# EAGLE design femto-beacon-esp32 (EAGLE 9.3.0)

## Sheet 1 of 7
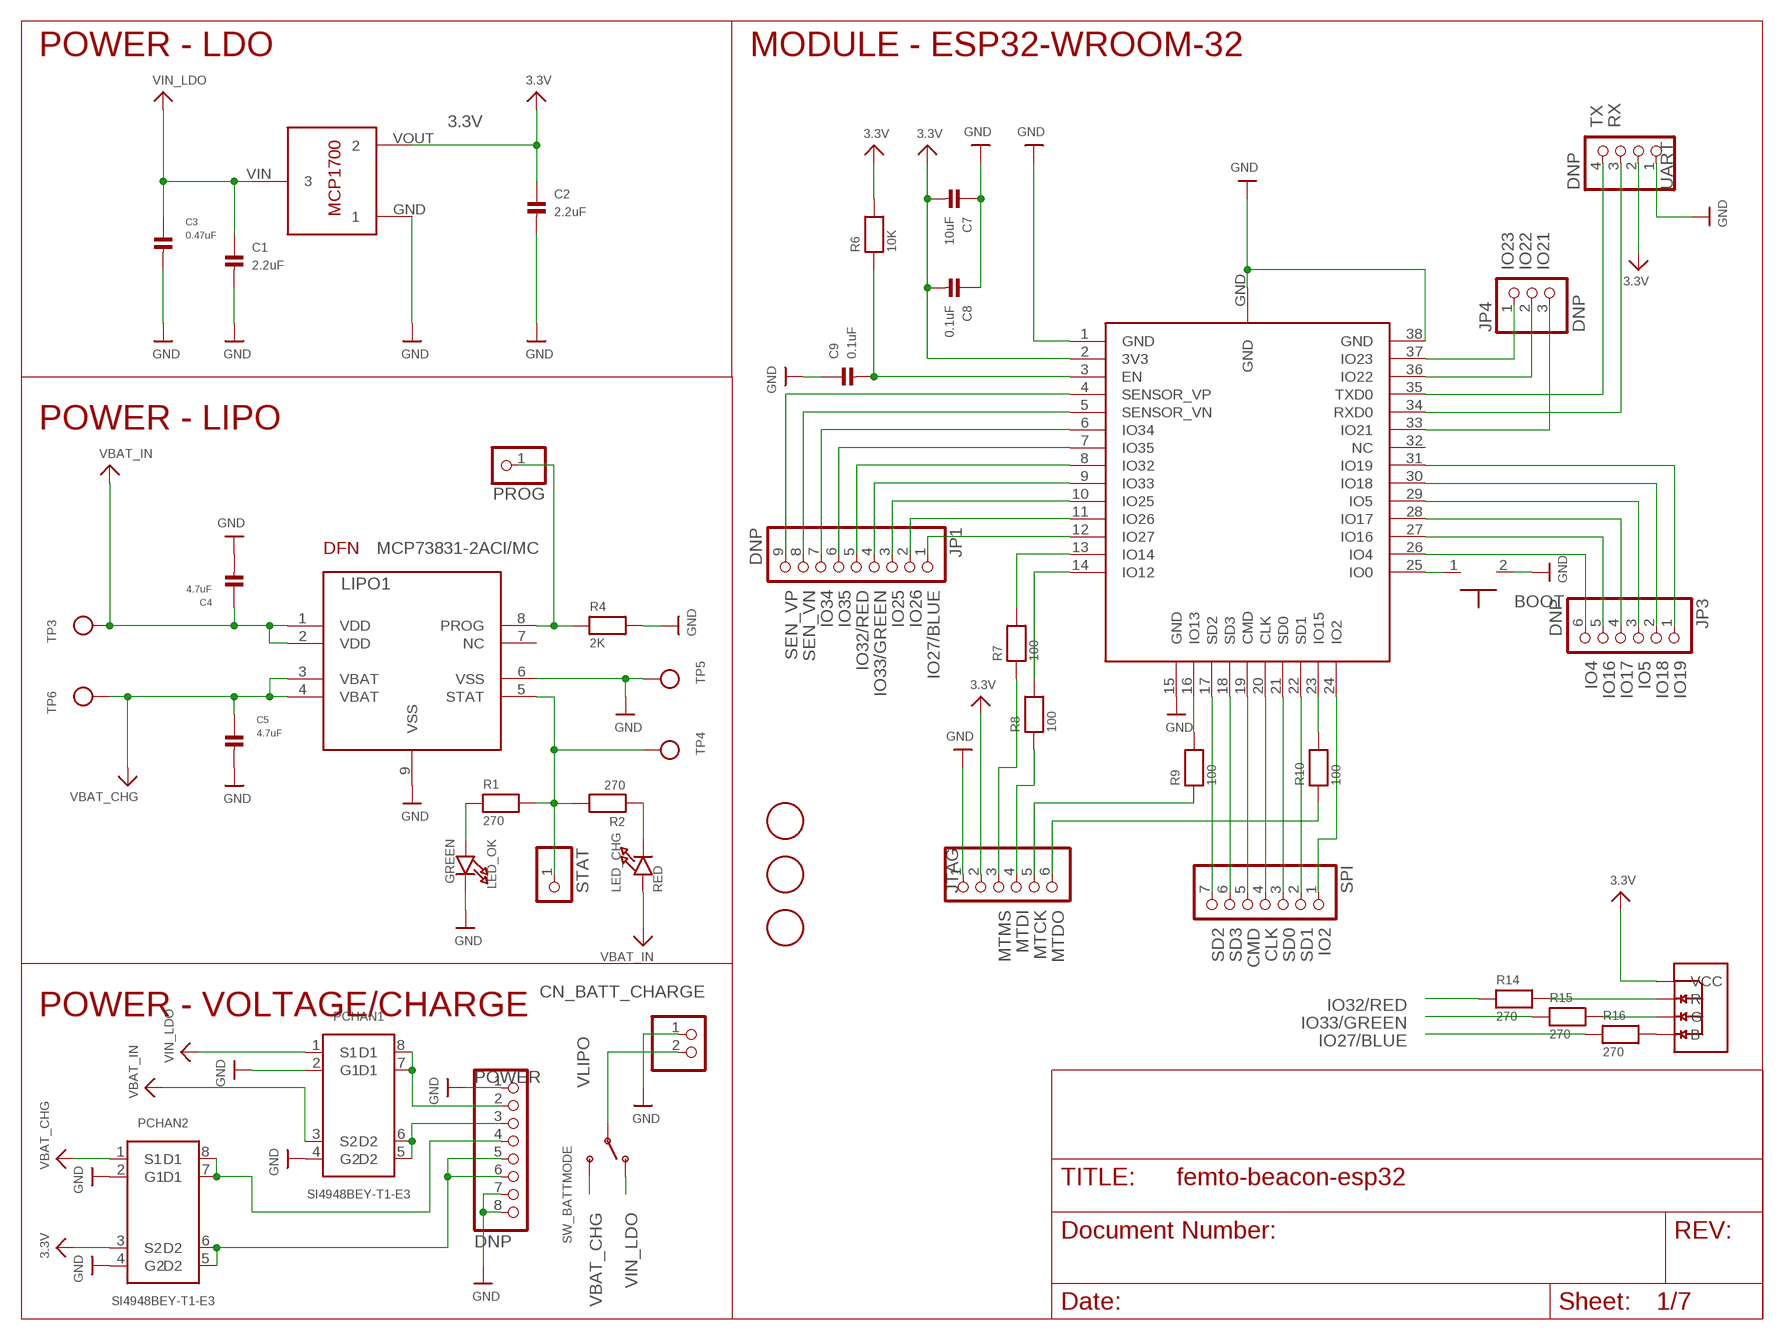
[diagram p0: schematic, sheet 1]

### Parts
BOOT  TACTILE_SWITCH_NO_GND_NO_BOSS  [SIDE_ACT_NO_GND_NO_BOSS]
C1  2.2uF  CAP_CERAMIC_0402MP  [_0402MP]
C2  2.2uF  CAP_CERAMIC_0402MP  [_0402MP]
C3  0.47uF  CAP_CERAMIC_0402MP  [_0402MP]
C4  4.7uF  CAP_CERAMIC_0402MP  [_0402MP]
C5  4.7uF  CAP_CERAMIC_0402MP  [_0402MP]
C7  10uF  CAP_CERAMIC_0603MP  [_0603MP]
C8  0.1uF  CAP_CERAMIC_0402MP  [_0402MP]
C9  0.1uF  CAP_CERAMIC_0402MP  [_0402MP]
CN_BATT_CHARGE  JST_2PIN  [JSTPH2]
FID1  FIDUCIAL  [FIDUCIAL_1MM]
FID2  FIDUCIAL  [FIDUCIAL_1MM]
FID3  FIDUCIAL  [FIDUCIAL_1MM]
JP1  DNP  PINHD-1X9  [1X09]
JP3  DNP  PINHD-1X6  [1X06]
JP4  DNP  PINHD-1X3  [1X03]
JTAG  HEADER-1X6ROUND  [1X06_ROUND]
LDO1  3.3V  MCP1700T-3302E/TT  [MCP1700T-3302E/TT]
LED_CHG  RED  LED0603_NOOUTLINE  [CHIPLED_0603_NOOUTLINE]
LED_OK  GREEN  LED0603_NOOUTLINE  [CHIPLED_0603_NOOUTLINE]
LIPO1  MCP73831-2ACI/MC  [2X3_DFN]
MOD1  ESP32-WROOM-32  [ESP32-WROOM-32-MODULE]
PCHAN1  SI4948BEY-T1-E3  [SO-8]
PCHAN2  SI4948BEY-T1-E3  [SO-8]
POWER  DNP  HEADER-1X8  [1X08_OVAL]
PROG  HEADER-1X1ROUND  [1X01_ROUND]
R1  270  RESISTOR_0402MP  [_0402MP]
R2  270  RESISTOR_0402MP  [_0402MP]
R4  2K  RESISTOR_0402MP  [_0402MP]
R6  10K  RESISTOR_0402MP  [_0402MP]
R7  100  RESISTOR_0402MP  [_0402MP]
R8  100  RESISTOR_0402MP  [_0402MP]
R9  100  RESISTOR_0402MP  [_0402MP]
R10  100  RESISTOR_0402MP  [_0402MP]
R14  270  RESISTOR_0402MP  [_0402MP]
R15  270  RESISTOR_0402MP  [_0402MP]
R16  270  RESISTOR_0402MP  [_0402MP]
RGB1  LRTB_R48G  [LRTB_R48G]
SPI  HEADER-1X7ROUND  [1X07_ROUND]
STAT  HEADER-1X1ROUND  [1X01_ROUND]
SW_BATTMODE  SWITCH_SPDT  [SPDT_SMT_SSSS811101]
TP3  TESTPOINTROUND0.5MM  [TESTPOINT_ROUND_0.5MM]
TP4  TESTPOINTROUND0.5MM  [TESTPOINT_ROUND_0.5MM]
TP5  TESTPOINTROUND0.5MM  [TESTPOINT_ROUND_0.5MM]
TP6  TESTPOINTROUND0.5MM  [TESTPOINT_ROUND_0.5MM]
UART  DNP  HEADER-1X4ROUND  [1X04_ROUND]

### Nets
BOOT: BOOT.1 MOD1.25(IO0)
CLK: MOD1.20(CLK) SPI.4
CMD: MOD1.19(CMD) SPI.5
EN: C9.2 MOD1.3(EN) R6.1
GND: BOOT.2 C1.2 C2.2 C3.2 C4.2 C5.2 C7.1 C8.1 C9.1 CN_BATT_CHARGE.1 JTAG.1 LDO1.GND LED_OK.C LIPO1.6(VSS) LIPO1.9(VSS) MOD1.1(GND) MOD1.15(GND) MOD1.38(GND) MOD1.GND PCHAN1.2(G1) PCHAN1.4(G2) PCHAN2.2(G1) PCHAN2.4(G2) POWER.1 POWER.7 POWER.8 R4.2 TP5.P$1 UART.1 ; also sheet 2
IO2: MOD1.24(IO2) SPI.1
IO4: JP3.6 MOD1.26(IO4)
IO5: JP3.3 MOD1.29(IO5)
IO16: JP3.5 MOD1.27(IO16)
IO17: JP3.4 MOD1.28(IO17)
IO18: JP3.2 MOD1.30(IO18)
IO19: JP3.1 MOD1.31(IO19)
IO21: JP4.3 MOD1.33(IO21)
IO22: JP4.2 MOD1.36(IO22)
IO23: JP4.1 MOD1.37(IO23)
IO25: JP1.3 MOD1.10(IO25)
IO26: JP1.2 MOD1.11(IO26)
IO27/BLUE: JP1.1 MOD1.12(IO27) R16.1
IO32/RED: JP1.5 MOD1.8(IO32) R14.1
IO33/GREEN: JP1.4 MOD1.9(IO33) R15.1
IO34: JP1.7 MOD1.6(IO34)
IO35: JP1.6 MOD1.7(IO35)
MTCK: JTAG.5 R9.1
MTDI: JTAG.4 R8.1
MTDI_: MOD1.14(IO12) R8.2
MTDO: JTAG.6 R10.1
MTMS: JTAG.3 R7.1
N$1: PCHAN1.7(D1) PCHAN1.8(D1) POWER.2
N$6: R16.2 RGB1.4(B)
N$7: MOD1.13(IO14) R7.2
N$8: R15.2 RGB1.3(G)
N$9: LED_OK.A R1.1
N$10: LED_CHG.C R2.1
N$11: R14.2 RGB1.2(R)
N$14: PCHAN1.5(D2) PCHAN1.6(D2) POWER.3
N$15: PCHAN2.7(D1) PCHAN2.8(D1) POWER.4
N$16: PCHAN2.5(D2) PCHAN2.6(D2) POWER.5 POWER.6
N$18: MOD1.16(IO13) R9.2
N$19: MOD1.23(IO15) R10.2
PROG: LIPO1.8(PROG) PROG.1 R4.1
RX: MOD1.34(RXD0) UART.3 ; also sheet 2
SD0: MOD1.21(SD0) SPI.3
SD1: MOD1.22(SD1) SPI.2
SD2: MOD1.17(SD2) SPI.7
SD3: MOD1.18(SD3) SPI.6
SEN_VN: JP1.8 MOD1.5(SENSOR_VN)
SEN_VP: JP1.9 MOD1.4(SENSOR_VP)
STAT: LIPO1.5(STAT) R1.2 R2.2 STAT.1 TP4.P$1
TX: MOD1.35(TXD0) UART.4 ; also sheet 2
VBAT_CHG: C5.1 LIPO1.3(VBAT) LIPO1.4(VBAT) PCHAN2.1(S1) SW_BATTMODE.C(S) TP6.P$1
VBAT_IN: C4.1 LED_CHG.A LIPO1.1(VDD) LIPO1.2(VDD) PCHAN1.3(S2) TP3.P$1 ; also sheet 2
VCC: C2.1 C7.2 C8.2 JTAG.2 LDO1.VOUT MOD1.2(3V3) PCHAN2.3(S2) R6.2 RGB1.1(VCC) UART.2 ; supply symbol labelled 3.3V
VIN_LDO: C1.1 C3.1 LDO1.VIN PCHAN1.1(S1) SW_BATTMODE.A(O) ; also sheet 2
VLIPO: CN_BATT_CHARGE.2 SW_BATTMODE.B(P)
Unconnected: LIPO1.7(NC) MOD1.32(NC)

### Notes on the sheet
- POWER - LDO | MODULE - ESP32-WROOM-32
- POWER - LIPO
- POWER - VOLTAGE/CHARGE

## Sheet 2 of 7
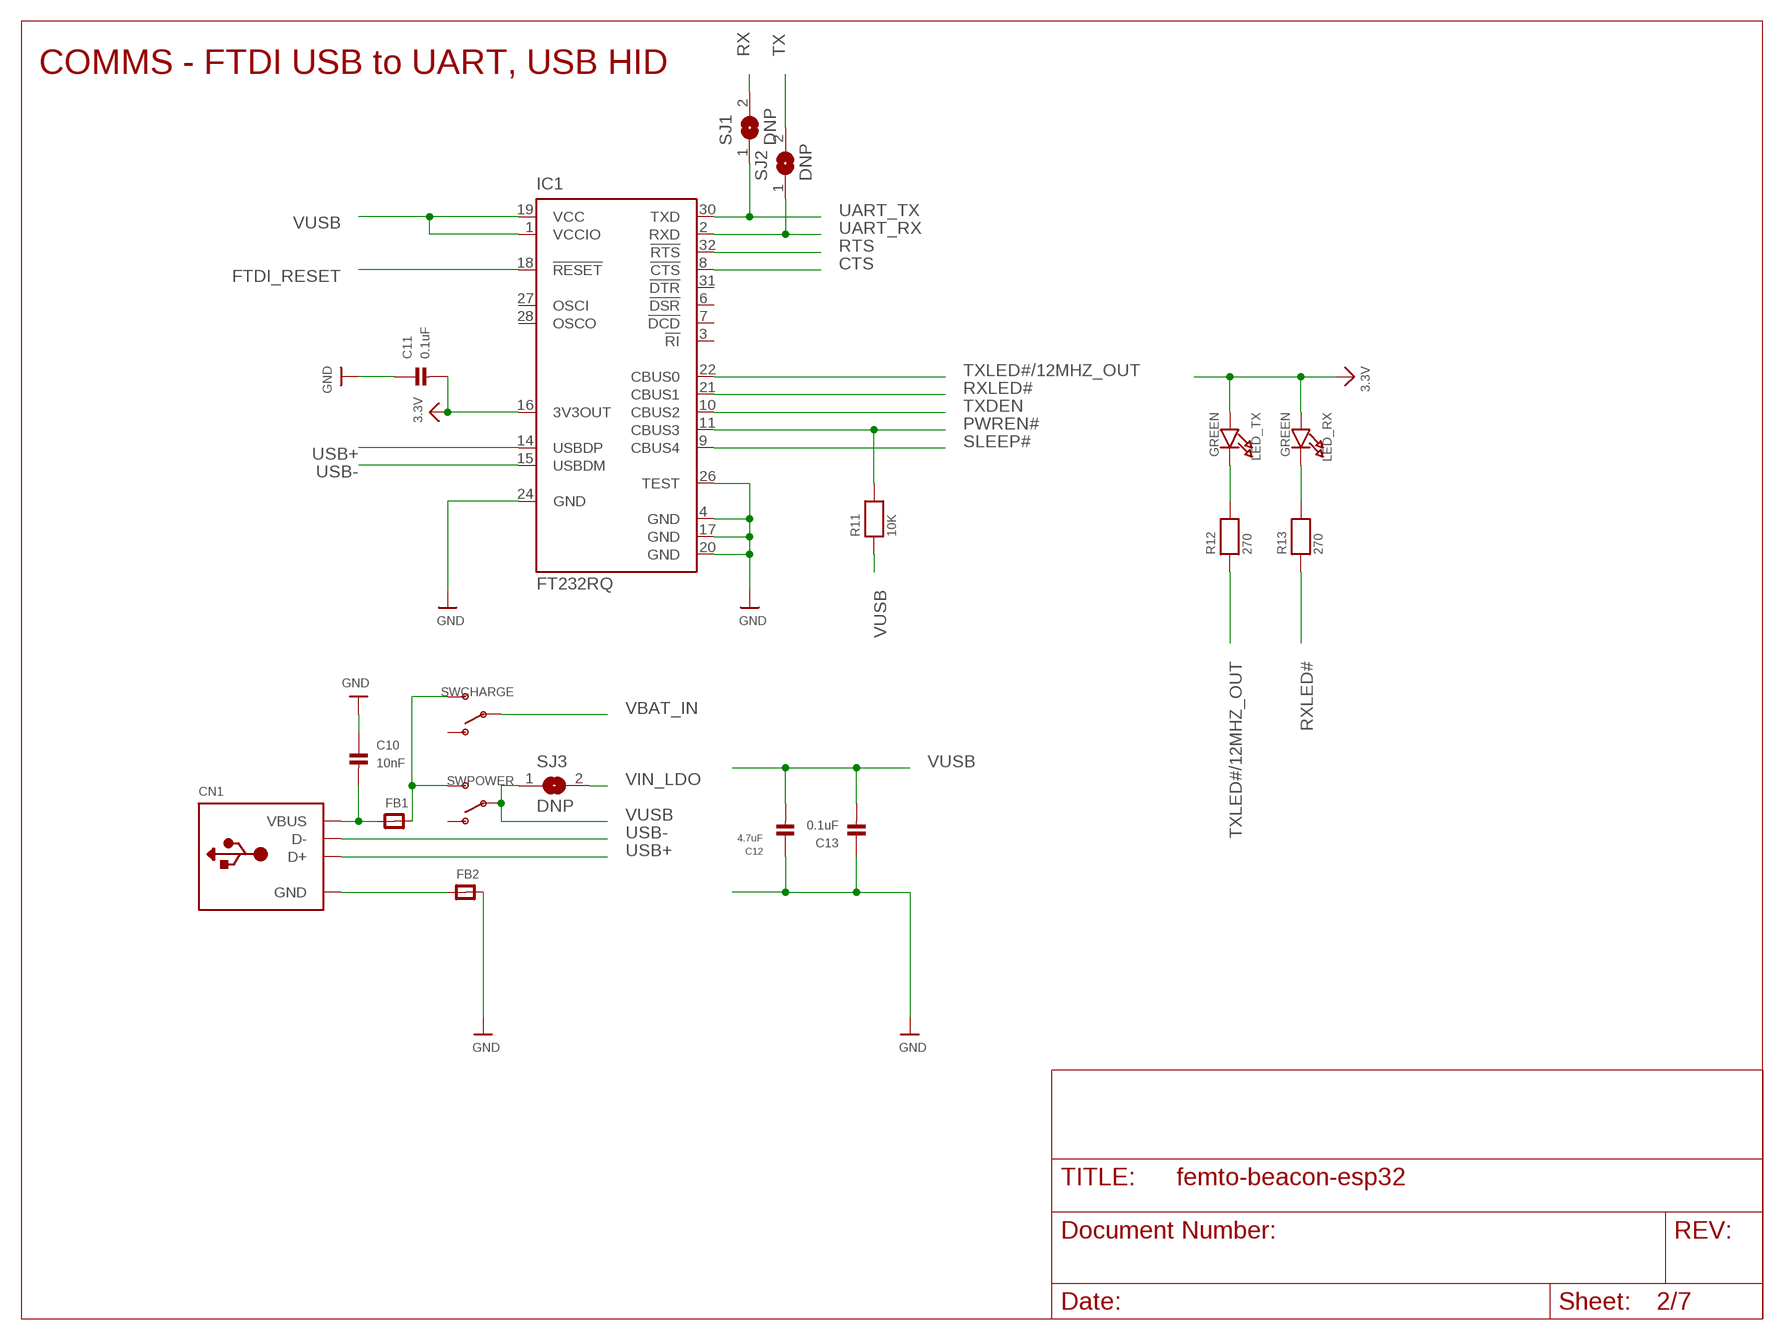
[diagram p1: schematic, sheet 2]

### Parts
C10  10nF  CAP_CERAMIC_0402MP  [_0402MP]
C11  0.1uF  CAP_CERAMIC_0402MP  [_0402MP]
C12  4.7uF  CAP_CERAMIC_0402MP  [_0402MP]
C13  0.1uF  CAP_CERAMIC_0402MP  [_0402MP]
CN1  USB_TYPEA  [USB_A-SMT]
FB1  FERRITE_0603MP  [_0603MP]
FB2  FERRITE_0603MP  [_0603MP]
IC1  FT232RQ  [QFN32]
LED_RX  GREEN  LED0603_NOOUTLINE  [CHIPLED_0603_NOOUTLINE]
LED_TX  GREEN  LED0603_NOOUTLINE  [CHIPLED_0603_NOOUTLINE]
R11  10K  RESISTOR_0402MP  [_0402MP]
R12  270  RESISTOR_0402MP  [_0402MP]
R13  270  RESISTOR_0402MP  [_0402MP]
SJ1  DNP  SOLDERJUMPERCLOSED  [SOLDERJUMPER_CLOSEDWIRE]
SJ2  DNP  SOLDERJUMPERCLOSED  [SOLDERJUMPER_CLOSEDWIRE]
SJ3  DNP  SOLDERJUMPERCLOSED  [SOLDERJUMPER_CLOSEDWIRE]
SWCHARGE  SWITCH_SPDT  [SPDT_SMT_SSSS811101]
SWPOWER  SWITCH_SPDT  [SPDT_SMT_SSSS811101]

### Nets
3.3V: C11.2 IC1.16(3V3OUT) LED_RX.A LED_TX.A
CTS: IC1.8(!CTS)
FTDI_RESET: IC1.18(!RESET)
GND: C10.1 C11.1 C12.1 C13.1 FB2.2 IC1.4(GND) IC1.17(GND) IC1.20(GND) IC1.24(GND) IC1.26(TEST) ; also sheet 1
GND_: CN1.GND FB2.1
N$4: LED_TX.C R12.2
N$5: LED_RX.C R13.2
PWREN#: IC1.11(CBUS3) R11.2
RTS: IC1.32(!RTS)
RX: SJ1.2 ; also sheet 1
RXLED#: IC1.21(CBUS1) R13.1
SLEEP#: IC1.9(CBUS4)
TX: SJ2.2 ; also sheet 1
TXDEN: IC1.10(CBUS2)
TXLED#/12MHZ_OUT: IC1.22(CBUS0) R12.1
UART_RX: IC1.2(RXD) SJ2.1
UART_TX: IC1.30(TXD) SJ1.1
USB+: CN1.D+ IC1.14(USBDP)
USB-: CN1.D- IC1.15(USBDM)
VBAT_IN: SWCHARGE.B(P) ; also sheet 1
VIN_LDO: SJ3.2 ; also sheet 1
VUSB: C12.2 C13.2 IC1.1(VCCIO) IC1.19(VCC) R11.1 SJ3.1 SWPOWER.B(P)
VUSB_: C10.2 CN1.VBUS FB1.1
VUSB_FILTERED: FB1.2 SWCHARGE.C(S) SWPOWER.C(S)
Unconnected: IC1.3(!RI) IC1.6(!DSR) IC1.7(!DCD) IC1.27(OSCI) IC1.28(OSCO) IC1.31(!DTR) SWCHARGE.A(O) SWPOWER.A(O)

### Notes on the sheet
- COMMS - FTDI USB to UART, USB HID

## Sheet 3 of 7
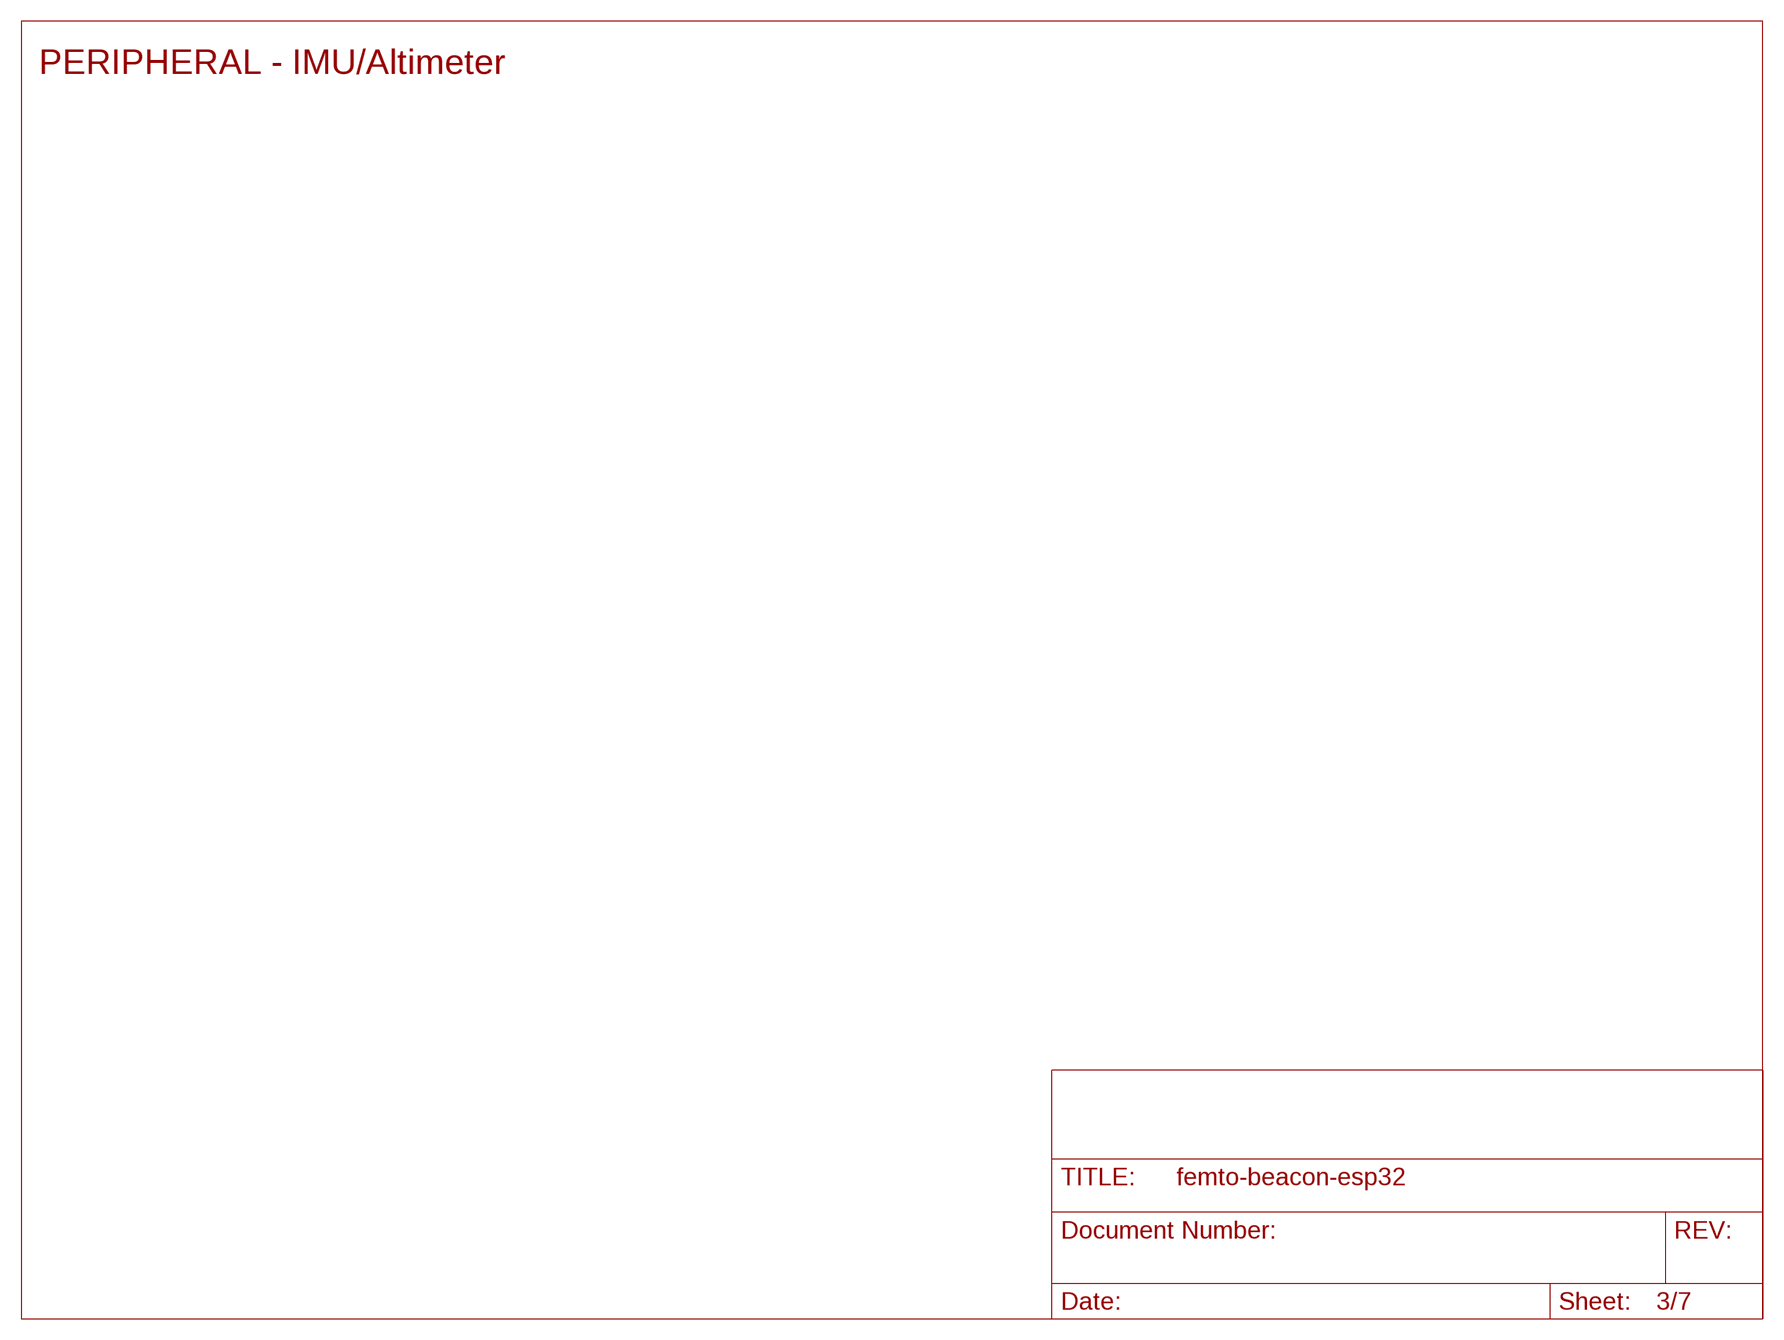
[diagram p2: schematic, sheet 3]

### Notes on the sheet
- PERIPHERAL - IMU/Altimeter

## Sheet 4 of 7
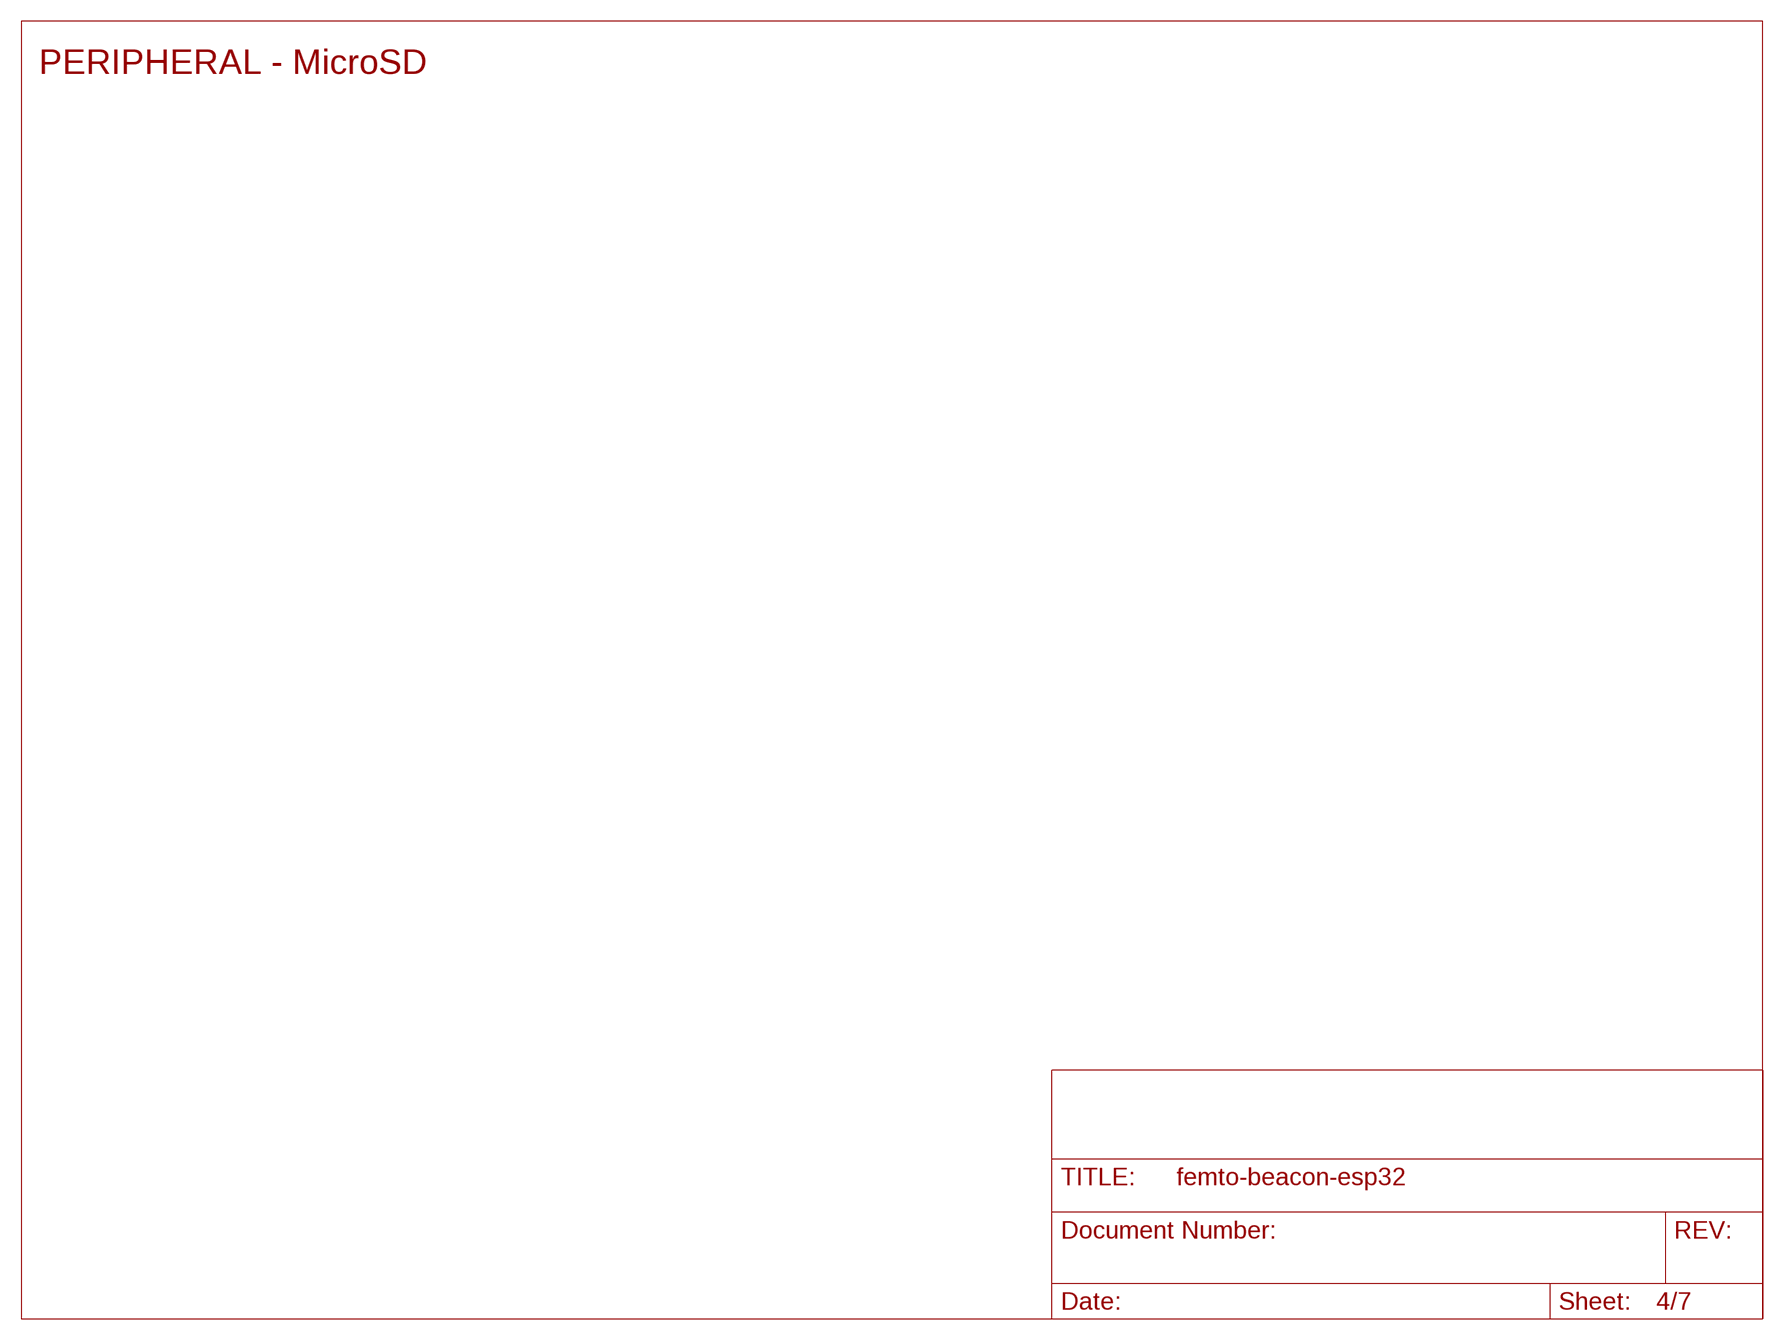
[diagram p3: schematic, sheet 4]

### Notes on the sheet
- PERIPHERAL - MicroSD

## Sheet 5 of 7
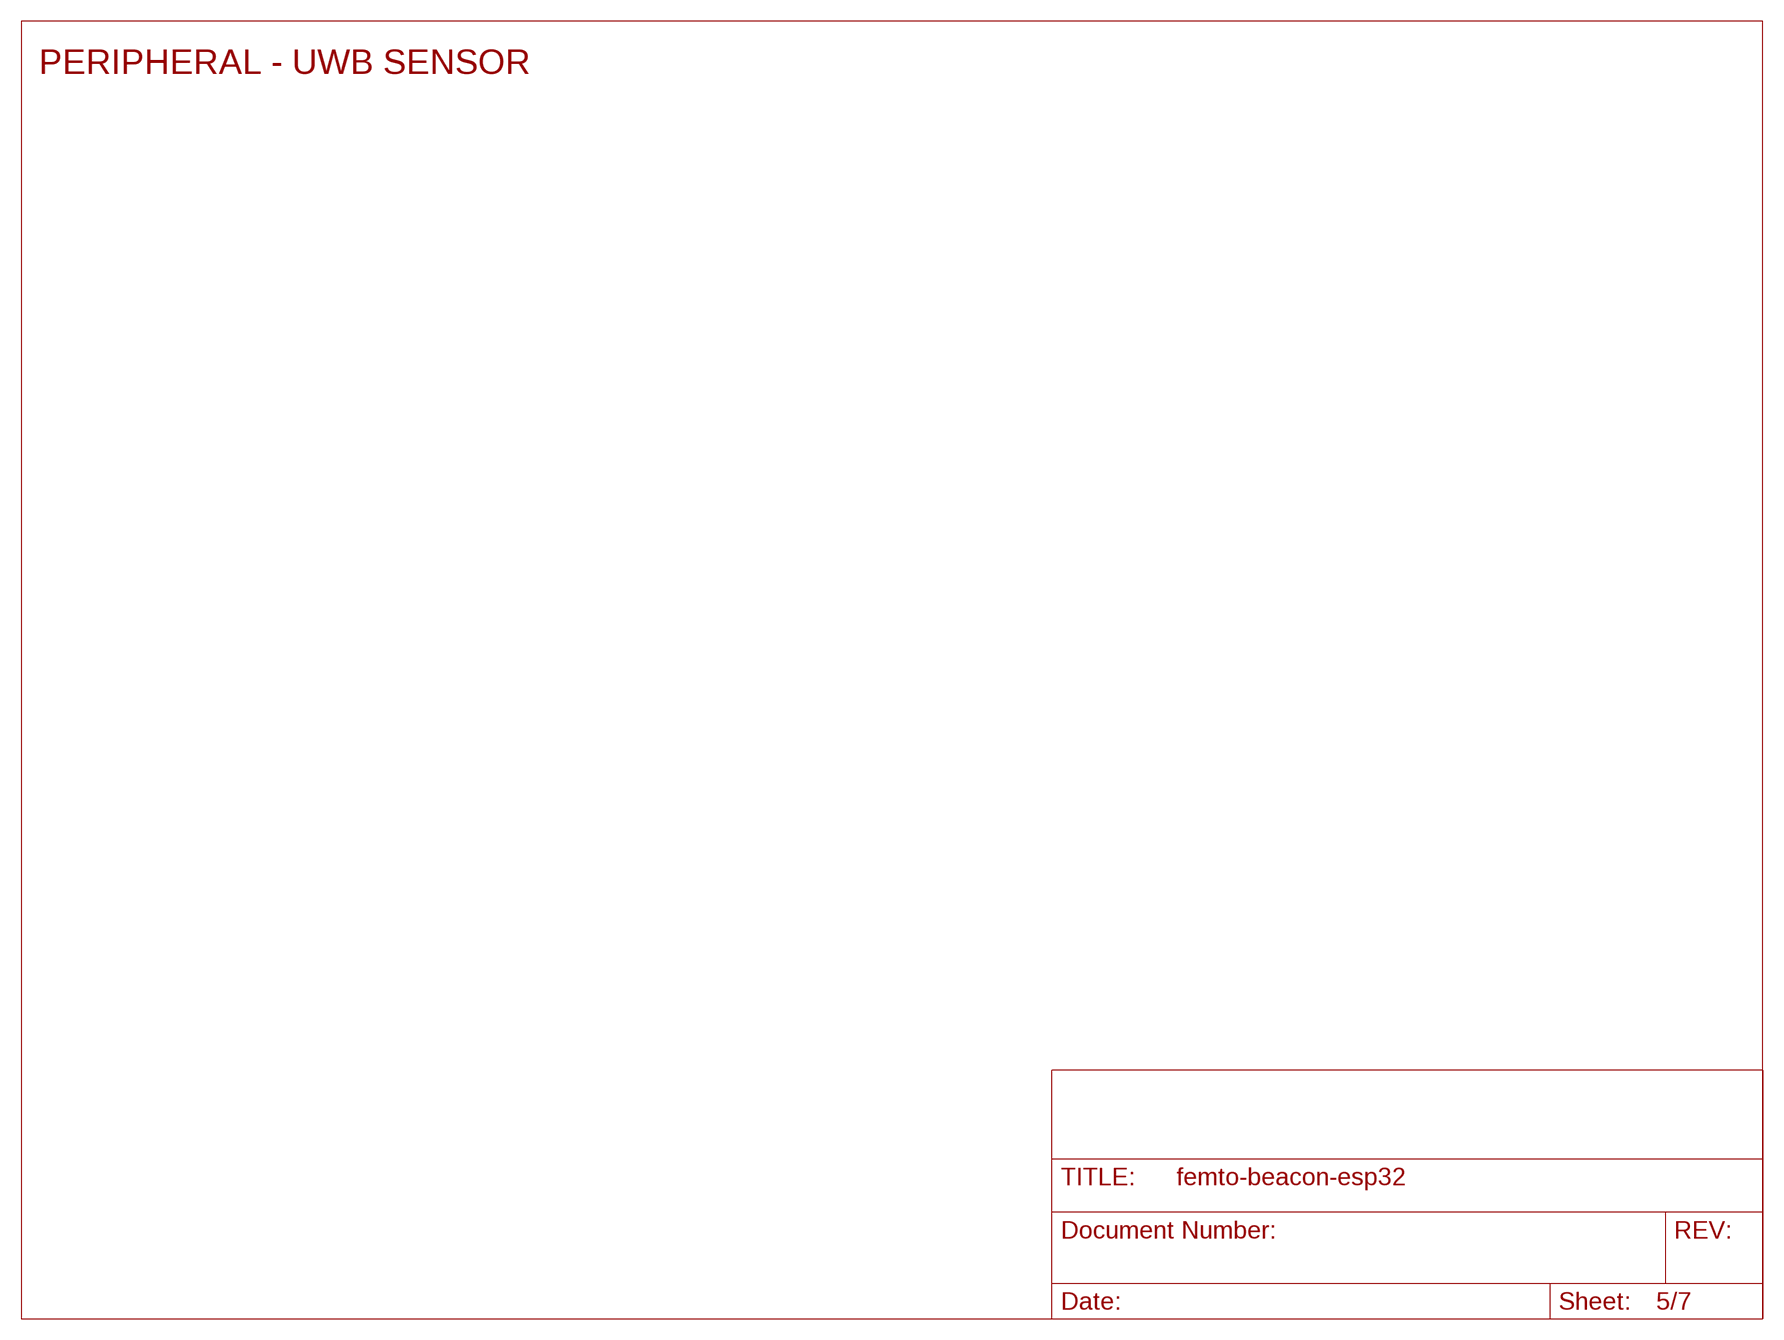
[diagram p4: schematic, sheet 5]

### Notes on the sheet
- PERIPHERAL - UWB SENSOR

## Sheet 6 of 7
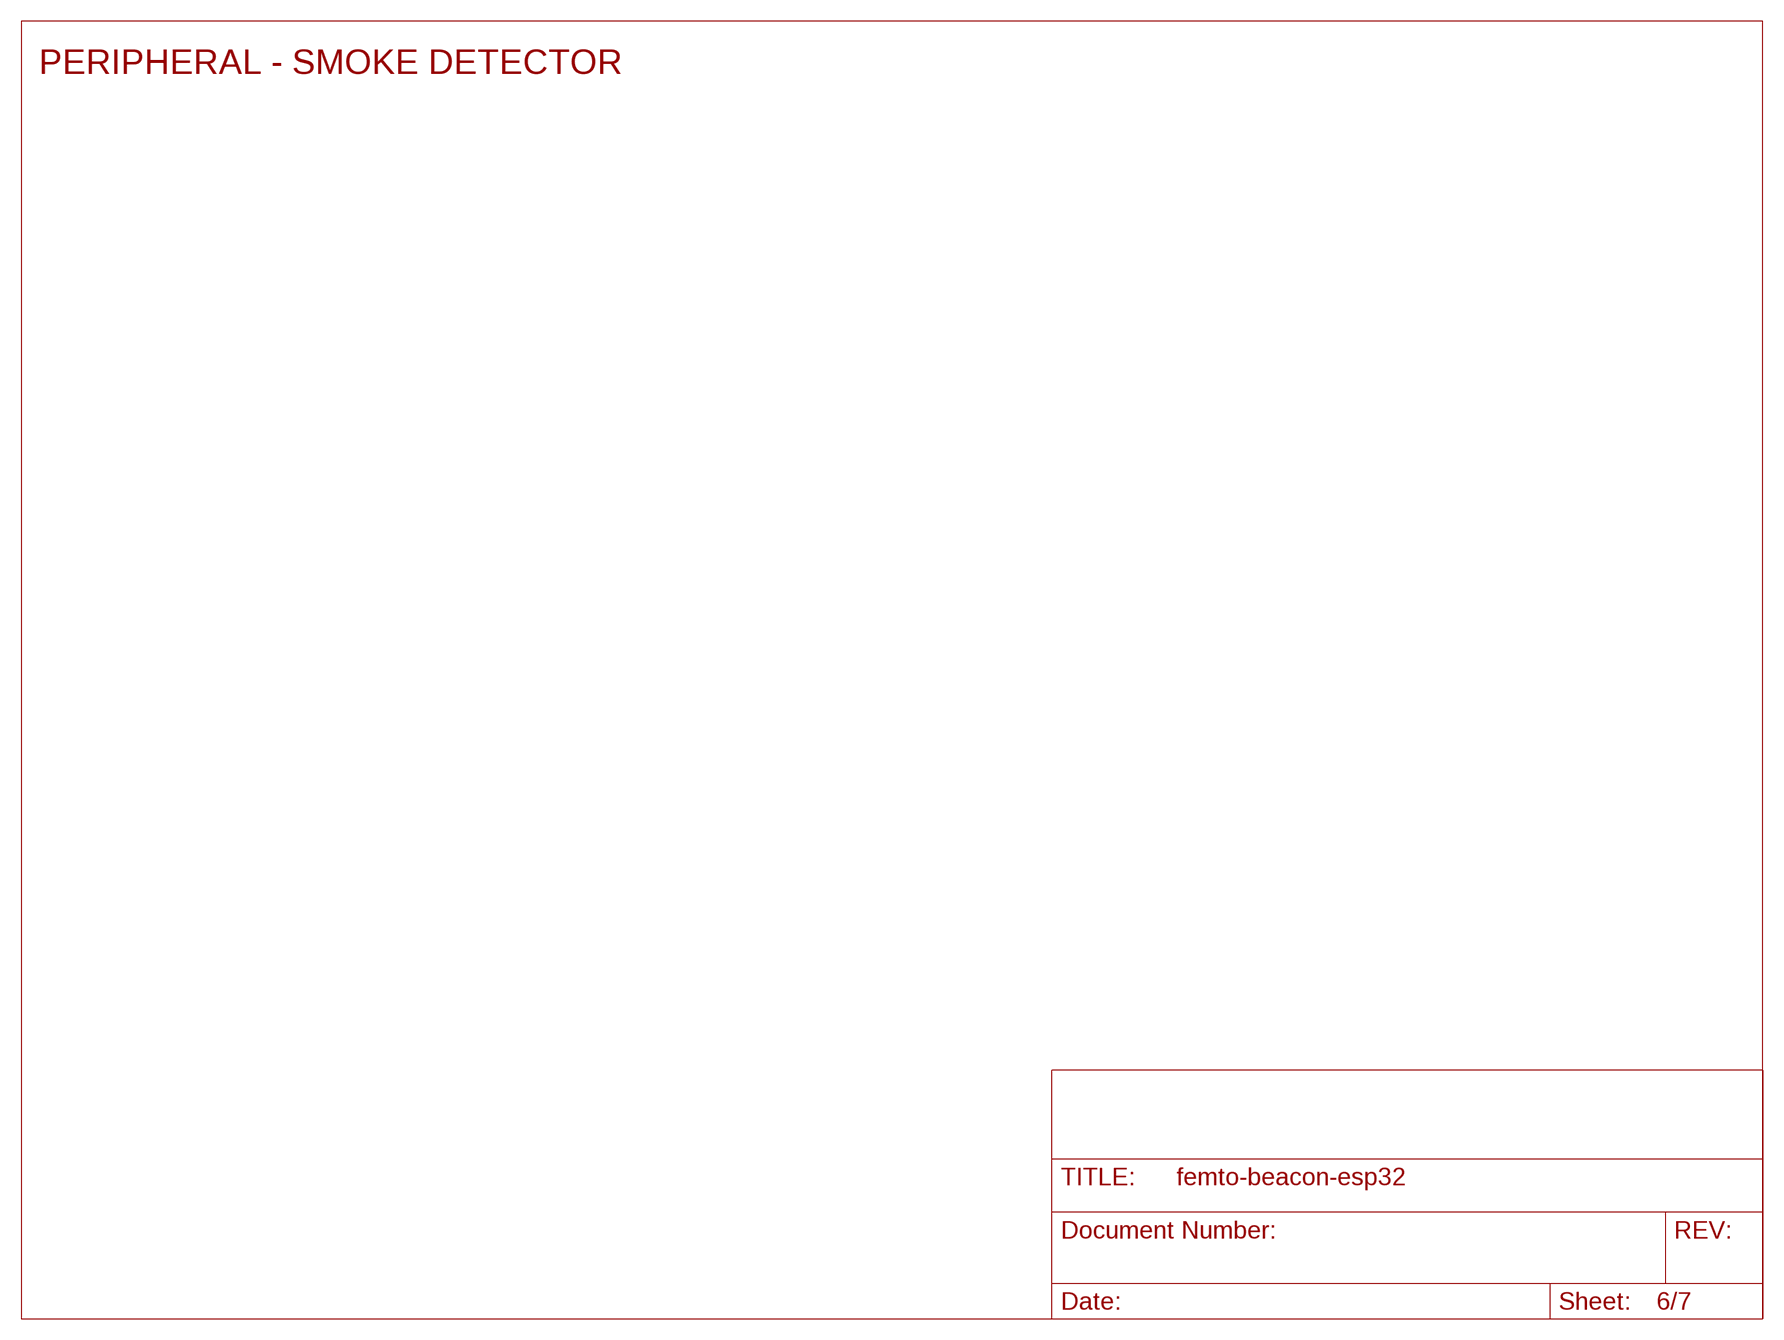
[diagram p5: schematic, sheet 6]

### Notes on the sheet
- PERIPHERAL - SMOKE DETECTOR

## Sheet 7 of 7
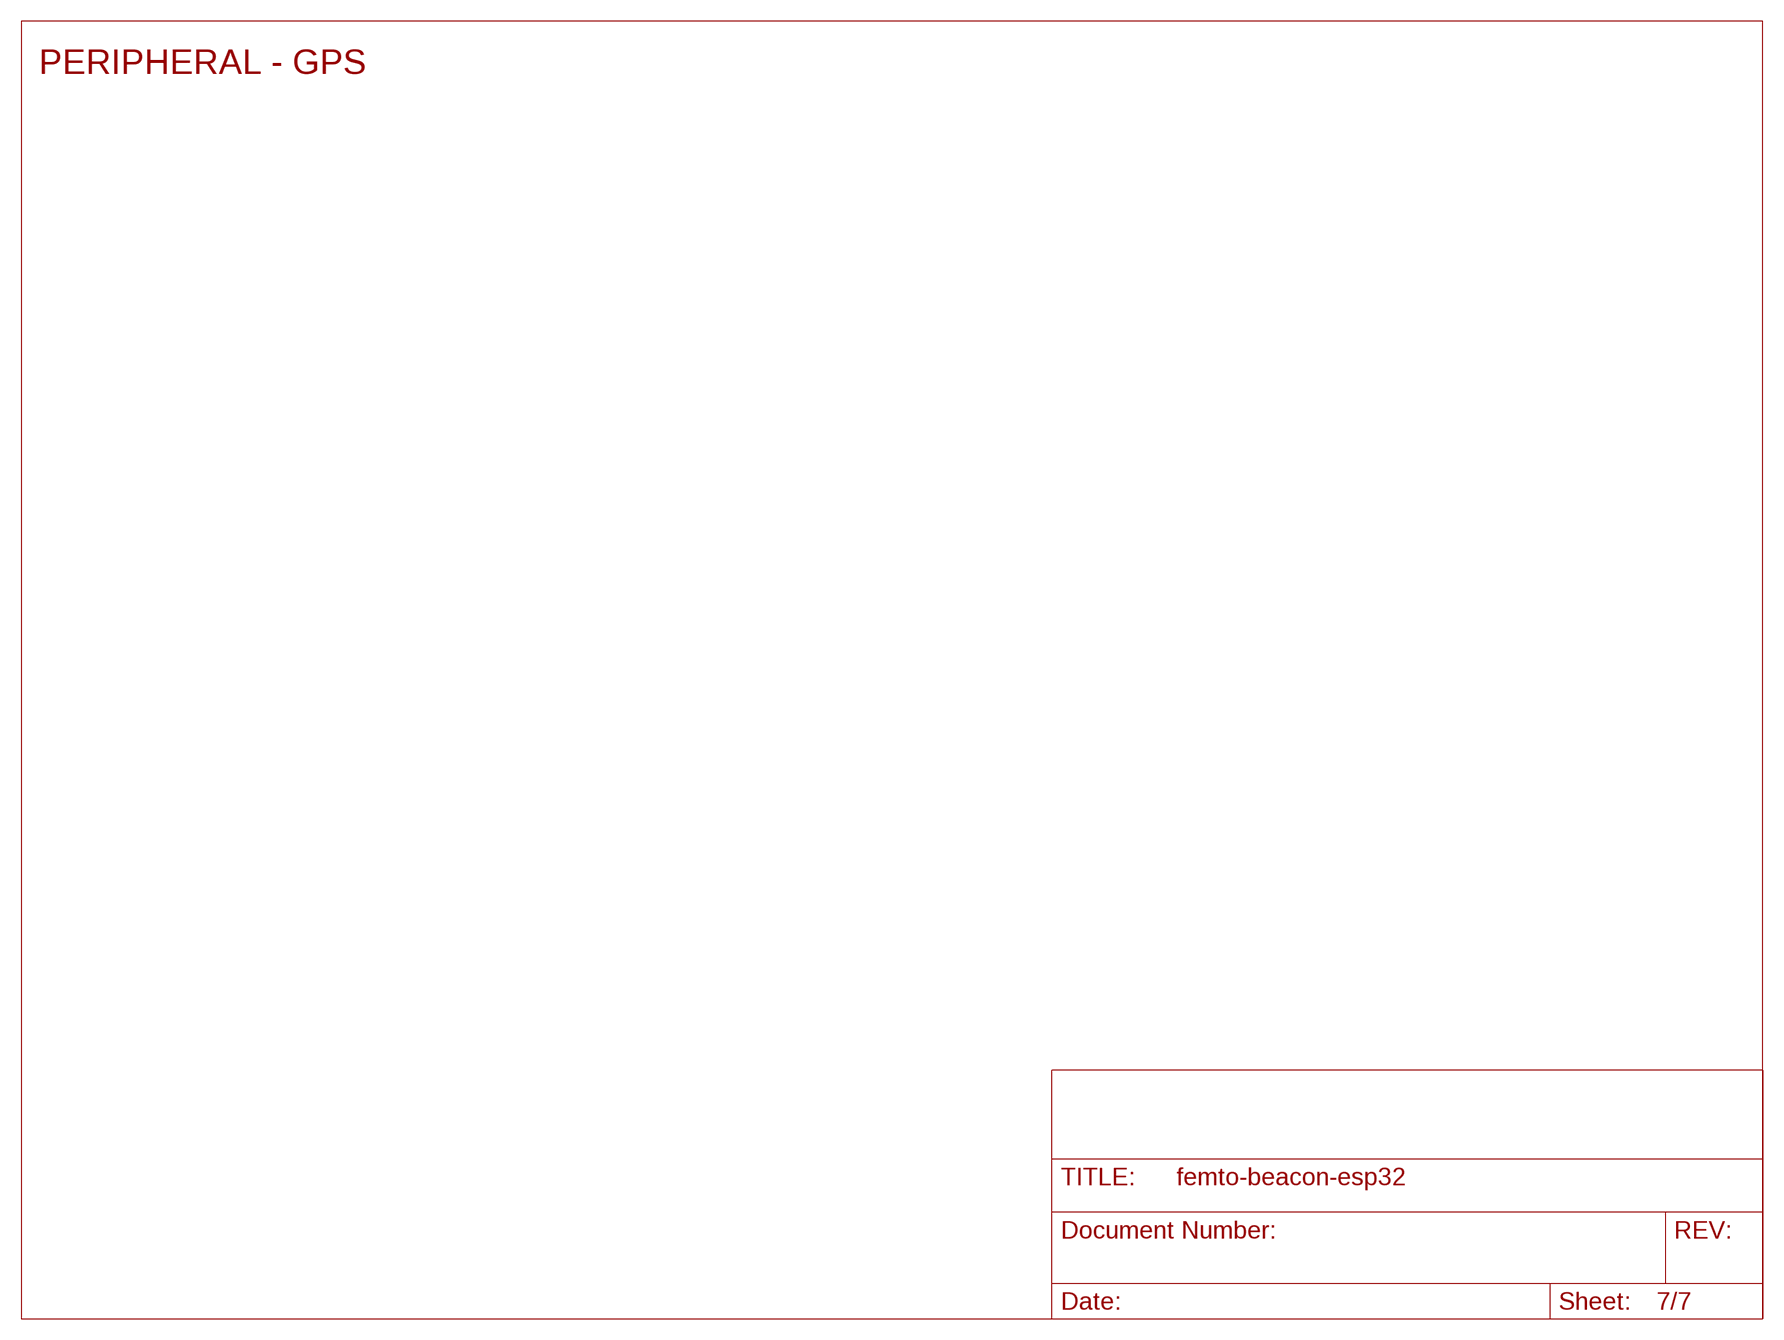
[diagram p6: schematic, sheet 7]

### Notes on the sheet
- PERIPHERAL - GPS

## Library data of the parts
BOOT = omron_tactile_switch:TACTILE_SWITCH_NO_GND_NO_BOSS: Omron tactile switch; MPN: B3U-3000P
C1 C2 = microbuilder:CAP_CERAMIC: Ceramic Capacitors 0402 - 0402 Surface Mount Capacitors 16pF 50V 5% [Digikey: 445-4899-2-ND] 18pF 50V 5% [Digikey: 490-1281-2-ND] 22pF 50V 5% [Digikey: 490-1283-2-ND] 68pF 50V 5% [Digikey: 490-1289-2-ND] 0.1uF 10V 10% [Digikey: 490-1318-2-ND] 1.0uF 6.3V 10% [Digikey: 490-1320-2-ND] 0603 - 0603 Surface Mount Capacitors 16 pF 50V 5% [Digikey: 445-5051-2-ND] 22 pF 50V [Digikey: PCC220ACVTR-ND] 33 pF 50V 5% [Digikey: 490-1415-1-ND] 56pF 50V 5% [Digikey: 490-1421-1-ND] 220pF 50V 5% [Digikey: 445-1285-1-ND] 680 pF 50V 2200 pF 50V 5% C0G [Digikey: 445-1297-1-ND] 5600 pF 100V 5% X7R [Digikey: 478-3711-1-ND] 0.1 µF 25V 10% [Digikey: PCC2277TR-ND] 0.22 µF 16V 10% X7R [Digikey: 445-1318-1-ND] 1.0 µF 25V 10% [Digikey: 445-5146-2-ND] 0603 - RF Specific 3pF 250V +/-0.1pF RF [Digikey: 712-1347-1-ND] 18 pF 250V 5% [Digikey: 478-3505-1-ND or 712-1322-1-ND] 56 pF 250V 5% C0G RF [Digikey: 490-4867-1-ND] 68 pF 250V RF [Digikey: 490-4868-1-ND] 0805 - 0805 Surface Mount Capacitors 220 pF 250V 2% RF Ceramic Capacitor [Digikey: 712-1398-1-ND] 1000 pF 50V 2% NP0 Ceramic Capacitor [Digikey: 478-3760-1-ND] 0.1 µF 25V 10% Ceramic Capacitor [Digikey: PCC1828TR-ND] 1.0 µF 16V 10% Ceramic Capacitor[Digikey: 490-1691-2-ND] 10.0 µF 10V 10% Ceramic Capacitor[Digikey: 709-1228-1-ND] 10.0 uF 16V 10% Ceramic Capacitor [Digikey: 478-5165-2-ND] 47 uF 6.3V 20% Ceramic Capacitor [Digikey: 587-1779-1-ND or 399-5506-1-ND] 1206 - 1206 Surface Mount Capacitors 47uF 10V 20% Ceramic Capacitor [Digikey: 490-5528-1-ND or 399-5508-1-ND or 445-6010-1-ND] 100uF 6.3V -20%, +80% Y5V Ceramic Capacitor (Digikey: 490-4512-1-ND, Mouser: 81-GRM31CF50J107ZE1L); MPN: C1005X5R0J225K050BC
C3 = microbuilder:CAP_CERAMIC: Ceramic Capacitors 0402 - 0402 Surface Mount Capacitors 16pF 50V 5% [Digikey: 445-4899-2-ND] 18pF 50V 5% [Digikey: 490-1281-2-ND] 22pF 50V 5% [Digikey: 490-1283-2-ND] 68pF 50V 5% [Digikey: 490-1289-2-ND] 0.1uF 10V 10% [Digikey: 490-1318-2-ND] 1.0uF 6.3V 10% [Digikey: 490-1320-2-ND] 0603 - 0603 Surface Mount Capacitors 16 pF 50V 5% [Digikey: 445-5051-2-ND] 22 pF 50V [Digikey: PCC220ACVTR-ND] 33 pF 50V 5% [Digikey: 490-1415-1-ND] 56pF 50V 5% [Digikey: 490-1421-1-ND] 220pF 50V 5% [Digikey: 445-1285-1-ND] 680 pF 50V 2200 pF 50V 5% C0G [Digikey: 445-1297-1-ND] 5600 pF 100V 5% X7R [Digikey: 478-3711-1-ND] 0.1 µF 25V 10% [Digikey: PCC2277TR-ND] 0.22 µF 16V 10% X7R [Digikey: 445-1318-1-ND] 1.0 µF 25V 10% [Digikey: 445-5146-2-ND] 0603 - RF Specific 3pF 250V +/-0.1pF RF [Digikey: 712-1347-1-ND] 18 pF 250V 5% [Digikey: 478-3505-1-ND or 712-1322-1-ND] 56 pF 250V 5% C0G RF [Digikey: 490-4867-1-ND] 68 pF 250V RF [Digikey: 490-4868-1-ND] 0805 - 0805 Surface Mount Capacitors 220 pF 250V 2% RF Ceramic Capacitor [Digikey: 712-1398-1-ND] 1000 pF 50V 2% NP0 Ceramic Capacitor [Digikey: 478-3760-1-ND] 0.1 µF 25V 10% Ceramic Capacitor [Digikey: PCC1828TR-ND] 1.0 µF 16V 10% Ceramic Capacitor[Digikey: 490-1691-2-ND] 10.0 µF 10V 10% Ceramic Capacitor[Digikey: 709-1228-1-ND] 10.0 uF 16V 10% Ceramic Capacitor [Digikey: 478-5165-2-ND] 47 uF 6.3V 20% Ceramic Capacitor [Digikey: 587-1779-1-ND or 399-5506-1-ND] 1206 - 1206 Surface Mount Capacitors 47uF 10V 20% Ceramic Capacitor [Digikey: 490-5528-1-ND or 399-5508-1-ND or 445-6010-1-ND] 100uF 6.3V -20%, +80% Y5V Ceramic Capacitor (Digikey: 490-4512-1-ND, Mouser: 81-GRM31CF50J107ZE1L); MPN: GRM155R60J474KE19D
C4 C5 C12 = microbuilder:CAP_CERAMIC: Ceramic Capacitors 0402 - 0402 Surface Mount Capacitors 16pF 50V 5% [Digikey: 445-4899-2-ND] 18pF 50V 5% [Digikey: 490-1281-2-ND] 22pF 50V 5% [Digikey: 490-1283-2-ND] 68pF 50V 5% [Digikey: 490-1289-2-ND] 0.1uF 10V 10% [Digikey: 490-1318-2-ND] 1.0uF 6.3V 10% [Digikey: 490-1320-2-ND] 0603 - 0603 Surface Mount Capacitors 16 pF 50V 5% [Digikey: 445-5051-2-ND] 22 pF 50V [Digikey: PCC220ACVTR-ND] 33 pF 50V 5% [Digikey: 490-1415-1-ND] 56pF 50V 5% [Digikey: 490-1421-1-ND] 220pF 50V 5% [Digikey: 445-1285-1-ND] 680 pF 50V 2200 pF 50V 5% C0G [Digikey: 445-1297-1-ND] 5600 pF 100V 5% X7R [Digikey: 478-3711-1-ND] 0.1 µF 25V 10% [Digikey: PCC2277TR-ND] 0.22 µF 16V 10% X7R [Digikey: 445-1318-1-ND] 1.0 µF 25V 10% [Digikey: 445-5146-2-ND] 0603 - RF Specific 3pF 250V +/-0.1pF RF [Digikey: 712-1347-1-ND] 18 pF 250V 5% [Digikey: 478-3505-1-ND or 712-1322-1-ND] 56 pF 250V 5% C0G RF [Digikey: 490-4867-1-ND] 68 pF 250V RF [Digikey: 490-4868-1-ND] 0805 - 0805 Surface Mount Capacitors 220 pF 250V 2% RF Ceramic Capacitor [Digikey: 712-1398-1-ND] 1000 pF 50V 2% NP0 Ceramic Capacitor [Digikey: 478-3760-1-ND] 0.1 µF 25V 10% Ceramic Capacitor [Digikey: PCC1828TR-ND] 1.0 µF 16V 10% Ceramic Capacitor[Digikey: 490-1691-2-ND] 10.0 µF 10V 10% Ceramic Capacitor[Digikey: 709-1228-1-ND] 10.0 uF 16V 10% Ceramic Capacitor [Digikey: 478-5165-2-ND] 47 uF 6.3V 20% Ceramic Capacitor [Digikey: 587-1779-1-ND or 399-5506-1-ND] 1206 - 1206 Surface Mount Capacitors 47uF 10V 20% Ceramic Capacitor [Digikey: 490-5528-1-ND or 399-5508-1-ND or 445-6010-1-ND] 100uF 6.3V -20%, +80% Y5V Ceramic Capacitor (Digikey: 490-4512-1-ND, Mouser: 81-GRM31CF50J107ZE1L); MPN: GRM155R60G475ME47D
C7 = microbuilder:CAP_CERAMIC: Ceramic Capacitors 0402 - 0402 Surface Mount Capacitors 16pF 50V 5% [Digikey: 445-4899-2-ND] 18pF 50V 5% [Digikey: 490-1281-2-ND] 22pF 50V 5% [Digikey: 490-1283-2-ND] 68pF 50V 5% [Digikey: 490-1289-2-ND] 0.1uF 10V 10% [Digikey: 490-1318-2-ND] 1.0uF 6.3V 10% [Digikey: 490-1320-2-ND] 0603 - 0603 Surface Mount Capacitors 16 pF 50V 5% [Digikey: 445-5051-2-ND] 22 pF 50V [Digikey: PCC220ACVTR-ND] 33 pF 50V 5% [Digikey: 490-1415-1-ND] 56pF 50V 5% [Digikey: 490-1421-1-ND] 220pF 50V 5% [Digikey: 445-1285-1-ND] 680 pF 50V 2200 pF 50V 5% C0G [Digikey: 445-1297-1-ND] 5600 pF 100V 5% X7R [Digikey: 478-3711-1-ND] 0.1 µF 25V 10% [Digikey: PCC2277TR-ND] 0.22 µF 16V 10% X7R [Digikey: 445-1318-1-ND] 1.0 µF 25V 10% [Digikey: 445-5146-2-ND] 0603 - RF Specific 3pF 250V +/-0.1pF RF [Digikey: 712-1347-1-ND] 18 pF 250V 5% [Digikey: 478-3505-1-ND or 712-1322-1-ND] 56 pF 250V 5% C0G RF [Digikey: 490-4867-1-ND] 68 pF 250V RF [Digikey: 490-4868-1-ND] 0805 - 0805 Surface Mount Capacitors 220 pF 250V 2% RF Ceramic Capacitor [Digikey: 712-1398-1-ND] 1000 pF 50V 2% NP0 Ceramic Capacitor [Digikey: 478-3760-1-ND] 0.1 µF 25V 10% Ceramic Capacitor [Digikey: PCC1828TR-ND] 1.0 µF 16V 10% Ceramic Capacitor[Digikey: 490-1691-2-ND] 10.0 µF 10V 10% Ceramic Capacitor[Digikey: 709-1228-1-ND] 10.0 uF 16V 10% Ceramic Capacitor [Digikey: 478-5165-2-ND] 47 uF 6.3V 20% Ceramic Capacitor [Digikey: 587-1779-1-ND or 399-5506-1-ND] 1206 - 1206 Surface Mount Capacitors 47uF 10V 20% Ceramic Capacitor [Digikey: 490-5528-1-ND or 399-5508-1-ND or 445-6010-1-ND] 100uF 6.3V -20%, +80% Y5V Ceramic Capacitor (Digikey: 490-4512-1-ND, Mouser: 81-GRM31CF50J107ZE1L); MPN: C1608X5R1A106K080AC
C8 C9 C11 C13 = microbuilder:CAP_CERAMIC: Ceramic Capacitors 0402 - 0402 Surface Mount Capacitors 16pF 50V 5% [Digikey: 445-4899-2-ND] 18pF 50V 5% [Digikey: 490-1281-2-ND] 22pF 50V 5% [Digikey: 490-1283-2-ND] 68pF 50V 5% [Digikey: 490-1289-2-ND] 0.1uF 10V 10% [Digikey: 490-1318-2-ND] 1.0uF 6.3V 10% [Digikey: 490-1320-2-ND] 0603 - 0603 Surface Mount Capacitors 16 pF 50V 5% [Digikey: 445-5051-2-ND] 22 pF 50V [Digikey: PCC220ACVTR-ND] 33 pF 50V 5% [Digikey: 490-1415-1-ND] 56pF 50V 5% [Digikey: 490-1421-1-ND] 220pF 50V 5% [Digikey: 445-1285-1-ND] 680 pF 50V 2200 pF 50V 5% C0G [Digikey: 445-1297-1-ND] 5600 pF 100V 5% X7R [Digikey: 478-3711-1-ND] 0.1 µF 25V 10% [Digikey: PCC2277TR-ND] 0.22 µF 16V 10% X7R [Digikey: 445-1318-1-ND] 1.0 µF 25V 10% [Digikey: 445-5146-2-ND] 0603 - RF Specific 3pF 250V +/-0.1pF RF [Digikey: 712-1347-1-ND] 18 pF 250V 5% [Digikey: 478-3505-1-ND or 712-1322-1-ND] 56 pF 250V 5% C0G RF [Digikey: 490-4867-1-ND] 68 pF 250V RF [Digikey: 490-4868-1-ND] 0805 - 0805 Surface Mount Capacitors 220 pF 250V 2% RF Ceramic Capacitor [Digikey: 712-1398-1-ND] 1000 pF 50V 2% NP0 Ceramic Capacitor [Digikey: 478-3760-1-ND] 0.1 µF 25V 10% Ceramic Capacitor [Digikey: PCC1828TR-ND] 1.0 µF 16V 10% Ceramic Capacitor[Digikey: 490-1691-2-ND] 10.0 µF 10V 10% Ceramic Capacitor[Digikey: 709-1228-1-ND] 10.0 uF 16V 10% Ceramic Capacitor [Digikey: 478-5165-2-ND] 47 uF 6.3V 20% Ceramic Capacitor [Digikey: 587-1779-1-ND or 399-5506-1-ND] 1206 - 1206 Surface Mount Capacitors 47uF 10V 20% Ceramic Capacitor [Digikey: 490-5528-1-ND or 399-5508-1-ND or 445-6010-1-ND] 100uF 6.3V -20%, +80% Y5V Ceramic Capacitor (Digikey: 490-4512-1-ND, Mouser: 81-GRM31CF50J107ZE1L); MPN: CC0402KRX7R6BB104
C10 = microbuilder:CAP_CERAMIC: Ceramic Capacitors 0402 - 0402 Surface Mount Capacitors 16pF 50V 5% [Digikey: 445-4899-2-ND] 18pF 50V 5% [Digikey: 490-1281-2-ND] 22pF 50V 5% [Digikey: 490-1283-2-ND] 68pF 50V 5% [Digikey: 490-1289-2-ND] 0.1uF 10V 10% [Digikey: 490-1318-2-ND] 1.0uF 6.3V 10% [Digikey: 490-1320-2-ND] 0603 - 0603 Surface Mount Capacitors 16 pF 50V 5% [Digikey: 445-5051-2-ND] 22 pF 50V [Digikey: PCC220ACVTR-ND] 33 pF 50V 5% [Digikey: 490-1415-1-ND] 56pF 50V 5% [Digikey: 490-1421-1-ND] 220pF 50V 5% [Digikey: 445-1285-1-ND] 680 pF 50V 2200 pF 50V 5% C0G [Digikey: 445-1297-1-ND] 5600 pF 100V 5% X7R [Digikey: 478-3711-1-ND] 0.1 µF 25V 10% [Digikey: PCC2277TR-ND] 0.22 µF 16V 10% X7R [Digikey: 445-1318-1-ND] 1.0 µF 25V 10% [Digikey: 445-5146-2-ND] 0603 - RF Specific 3pF 250V +/-0.1pF RF [Digikey: 712-1347-1-ND] 18 pF 250V 5% [Digikey: 478-3505-1-ND or 712-1322-1-ND] 56 pF 250V 5% C0G RF [Digikey: 490-4867-1-ND] 68 pF 250V RF [Digikey: 490-4868-1-ND] 0805 - 0805 Surface Mount Capacitors 220 pF 250V 2% RF Ceramic Capacitor [Digikey: 712-1398-1-ND] 1000 pF 50V 2% NP0 Ceramic Capacitor [Digikey: 478-3760-1-ND] 0.1 µF 25V 10% Ceramic Capacitor [Digikey: PCC1828TR-ND] 1.0 µF 16V 10% Ceramic Capacitor[Digikey: 490-1691-2-ND] 10.0 µF 10V 10% Ceramic Capacitor[Digikey: 709-1228-1-ND] 10.0 uF 16V 10% Ceramic Capacitor [Digikey: 478-5165-2-ND] 47 uF 6.3V 20% Ceramic Capacitor [Digikey: 587-1779-1-ND or 399-5506-1-ND] 1206 - 1206 Surface Mount Capacitors 47uF 10V 20% Ceramic Capacitor [Digikey: 490-5528-1-ND or 399-5508-1-ND or 445-6010-1-ND] 100uF 6.3V -20%, +80% Y5V Ceramic Capacitor (Digikey: 490-4512-1-ND, Mouser: 81-GRM31CF50J107ZE1L); MPN: GRM155R71E103KA01D
CN1 = microbuilder:USB_TYPEA: USB - Type A Connectors Male types stick out and are inserted into a PC or matching females parts (these are the connectors used on USB Memory Sticks, etc.). Female parts are generally used for USB Host and accept a male-type connector. SMT Male - 4UCON: 10017, or Digikey (Keystone 931, 36-931-ND) PTH Female - Digikey: 609-1045-ND, 4UCon: 05241; MPN: 36-931-ND
CN_BATT_CHARGE = microbuilder:JST_2PIN: JST 2-Pin Right-Angle Connector PH-Series - 4UConnector: 17311 SH-Series - 4UConnector: 07278; MPN: S2B-PH-SM4-TB(LF)(SN)
FB1 FB2 = microbuilder:FERRITE: Ferrite Bead 0603 MMZ1608B121C - 120 Ohm @ 100MHz, 600mA, 0.15 Ohm DC Resistance - Digikey: 445-2164-1-ND BK1608HW121-T - 120 Ohm, 600mA Ferrite Chip - Digikey: 587-1876-2-ND 0805 HZ0805B272R-10 - 2.7K Ohm @ 100MHz, 200mA, 0.8 Ohm DC Resistance - Digikey: 240-2504-1-ND (see also Murata BLM21BD272SN1L) MMZ2012Y152B - 1.5K Ohm @ 100MHz, 500mA, 0.4 Ohm DC Resistance - Digikey: 445-1560-1-ND - Mainly for high frequency (80-400MHz) MMZ2012R102A - 1K Ohm @ 100MHz, 500mA, 0.3 Ohm DC Resistance - Digikey: 445-1555-2-ND - More general purpose (10-200MHz); MPN: BLM18RK102SN1D
FID1-FID3 = adafruit:FIDUCIAL: For use by pick and place machines to calibrate the vision/machine, 1mm By microbuilder.eu
IC1 = ftdichip:FT232R: Source: http://www.ftdichip.com/Documents/DataSheets/DS_FT232R_v104.pdf; MPN: FT232RQ-REEL; OC_FARNELL: 1146033; OC_NEWARK: 91K9919
JP1 = pinhead:PINHD-1X9: PIN HEADER
JP3 = pinhead:PINHD-1X6: PIN HEADER
JP4 = pinhead:PINHD-1X3: PIN HEADER
JTAG = microbuilder:HEADER-1X6: PIN HEADER
LDO1 = MCP1700T-3302E_TT:MCP1700T-3302E/TT: Microchip LDO "MCP1700" in a 3-Pin SOT-23 package. ID: MCP1700T-3302E/TT; MPN: MCP1700T-3302E/TT
LED_CHG = microbuilder:LED: LED 0603 - 0603 Surface Mount Package 2mA: Green LED - Low Power (3.9mcd, 2ma, 1.7Vf) - Digikey: 475-2709-2-ND Orange LED - Low Power (9.8mcd, 2ma, 1.8Vf) - Digikey: 475-1194-2-ND Red LED - Low Power (5mcd, 2ma, 1.8Vf) - Digikey: 475-1195-2-ND Yellow LED - Low Power (7mcd, 2ma, 1.8Vf) - Digikey: 475-1196-2-ND 5mA: Blue LED - Low Power (17mcd, 5ma, 2.9Vf) - Digikey: LNJ937W8CRACT-ND 0805 - 0805 Surface Mount Package 2mA: Red LED (8.8mcd, 2mA, 1.8Vf, Clear) - Low Power [Digikey: 475-2510-1-ND] Green LED (5mcd, 2mA, 1.8Vf, Clear) - Low Power [Digikey: 475-2730-1-ND] Yellow LED (11.3mcd, 2mA, 1.8Vf, Clear) - Low Power [Digikey: 475-2555-1-ND] 20mA: Red LED (104mcd, 20mA, Diffused) - LS R976 [Digikey: 475-1278-6-ND] Red LED (12mcd, 20mA, 2.0Vf, Clear) - APT2012EC [Digikey: 754-1128-1-ND] Green LED (15mcd, 20mA, 2.2Vf, Clear) - APT2012GC [Digikey: 754-1131-1-ND] Orange LED (160mcd, 20mA, 2.1Vf, Clear) - APT2012SECK [Digikey: 754-1130-1-ND] 1206 - 1206 Surface Mount Package Green LED (26mcd, 20mA, Diffused) - LG N971 [Digikey: 475-1407-6-ND] Red LED (15mcd, 20mA, Diffused) - LH N974 [Digikey: 475-1416-6-ND]; MPN: 350-2029-1-ND
LED_OK LED_RX LED_TX = microbuilder:LED: LED 0603 - 0603 Surface Mount Package 2mA: Green LED - Low Power (3.9mcd, 2ma, 1.7Vf) - Digikey: 475-2709-2-ND Orange LED - Low Power (9.8mcd, 2ma, 1.8Vf) - Digikey: 475-1194-2-ND Red LED - Low Power (5mcd, 2ma, 1.8Vf) - Digikey: 475-1195-2-ND Yellow LED - Low Power (7mcd, 2ma, 1.8Vf) - Digikey: 475-1196-2-ND 5mA: Blue LED - Low Power (17mcd, 5ma, 2.9Vf) - Digikey: LNJ937W8CRACT-ND 0805 - 0805 Surface Mount Package 2mA: Red LED (8.8mcd, 2mA, 1.8Vf, Clear) - Low Power [Digikey: 475-2510-1-ND] Green LED (5mcd, 2mA, 1.8Vf, Clear) - Low Power [Digikey: 475-2730-1-ND] Yellow LED (11.3mcd, 2mA, 1.8Vf, Clear) - Low Power [Digikey: 475-2555-1-ND] 20mA: Red LED (104mcd, 20mA, Diffused) - LS R976 [Digikey: 475-1278-6-ND] Red LED (12mcd, 20mA, 2.0Vf, Clear) - APT2012EC [Digikey: 754-1128-1-ND] Green LED (15mcd, 20mA, 2.2Vf, Clear) - APT2012GC [Digikey: 754-1131-1-ND] Orange LED (160mcd, 20mA, 2.1Vf, Clear) - APT2012SECK [Digikey: 754-1130-1-ND] 1206 - 1206 Surface Mount Package Green LED (26mcd, 20mA, Diffused) - LG N971 [Digikey: 475-1407-6-ND] Red LED (15mcd, 20mA, Diffused) - LH N974 [Digikey: 475-1416-6-ND]; MPN: 350-2035-1-ND
LIPO1 = LiPO_MCP73831_2:MCP73831-2ACI/MC; MPN: MCP73831-2ACI/MC
MOD1 = esp32-wroom-32:ESP32-WROOM-32: ESP32 WiFi/Bluetooth module; MPN: ESP32-WROOM-32
PCHAN1 PCHAN2 = vishay_mosfet:SI4948BEY-T1-E3: Vishay dual P-Channel Mosfet SI4948BEY-T1-E3; MPN: SI4948BEY-T1-E3
POWER = microbuilder:HEADER-1X8: PIN HEADER
PROG STAT = microbuilder:HEADER-1X1: PIN HEADER
R1 R2 R12-R16 = microbuilder:RESISTOR: Resistors 0402 - 0402 Surface Mount Package 22 Ohm 1% 1/16W [Digikey: 311-22.0LRTR-ND] 33 Ohm 5% 1/16W 1.0K 5% 1/16W 1.5K 5% 1/16W 2.0K 1% 1/16W 10.0K 1% 1/16W [Digikey: 311-10.0KLRTR-ND] 10.0K 5% 1/16W [Digikey: RMCF0402JT10K0TR-ND] 12.1K 1% 1/16W [Digikey: 311-22.0LRTR-ND] 100.0K 5% 1/16W 0603 - 0603 Surface Mount Package 0 Ohm 1/10 Watt 1% Resistor 15 Ohm 1/10 Watt 1% Resistor 33 Ohm 1/10 Watt 1% Resistor 49.9 Ohm 1/10 Watt 1% Resistor 100 Ohm 1/10 Watt 1% Resistor 150 Ohm 1/10 Watt 1% Resistor 240 Ohm 1/10 Watt 1% Resistor 390 Ohm 1/10 Watt 1% Resistor 560 Ohm 1/10 Watt 1% Resistor 680 Ohm 1/10 Watt 1% Resistor 750 Ohm 1/10 Watt 1% Resistor 1.0K Ohm 1/10 Watt 1% Resistor 1.5K Ohm 1/10 Watt 1% Resistor 2.0K Ohm 1/10 Watt 1% Resistor 2.2K Ohm 1/10 Watt 1% Resistor 3.3K Ohm 1/10 Watt 1% Resistor 4.7K Ohm 1/10 Watt 1% Resistor 10.0K Ohm 1/10 Watt 1% Resistor 12.0K Ohm 1/10 Watt 1% Resistor 12.1K Ohm 1/10 Watt 1% Resistor 20.0K Ohm 1/10 Watt 1% Resistor 33.0K Ohm 1/10 Watt 1% Resistor 100.0K Ohm 1/10 Watt 1% Resistor 0805 - 0805 Surface Mount Package 0 Ohm 1/8 Watt 1% Resistor 33 Ohm 1/8 Watt 1% Resistor 100 Ohm 1/8 Watt 1% Resistor 150 Ohm 1/8 Watt 1% Resistor 200 Ohm 1/8 Watt 1% Resistor 240 Ohm 1/8 Watt 1% Resistor 330 Ohm 1/8 Watt 1% Resistor 390 Ohm 1/8 Watt 1% Resistor 470 Ohm 1/8 Watt 1% Resistor 1.0K Ohm 1/8 Watt 1% Resistor 1.5K Ohm 1/8 Watt 1% Resistor 2.0K Ohm 1/8 Watt 1% Resistor 4.7K Ohm 1/8 Watt 1% Resistor 5.1K Ohm 1/8 Watt 1% Resistor 5.6K Ohm 1/8 Watt 1% Resistor 10.0K Ohm 1/8 Watt 1% Resistor 22.0K Ohm 1/8 Watt 1% Resistor 33.0K Ohm 1/8 Watt 1% Resistor 100K Ohm 1/8 Watt 1% Resistor 1206 - 1206 Surface Mount Package 2012 - 2010 Surface Mount Package 0.11 Ohm 1/2 Watt 1% Resistor - Digikey: RHM.11UCT-ND; MPN: CRCW0402270RFKED
R4 = microbuilder:RESISTOR: Resistors 0402 - 0402 Surface Mount Package 22 Ohm 1% 1/16W [Digikey: 311-22.0LRTR-ND] 33 Ohm 5% 1/16W 1.0K 5% 1/16W 1.5K 5% 1/16W 2.0K 1% 1/16W 10.0K 1% 1/16W [Digikey: 311-10.0KLRTR-ND] 10.0K 5% 1/16W [Digikey: RMCF0402JT10K0TR-ND] 12.1K 1% 1/16W [Digikey: 311-22.0LRTR-ND] 100.0K 5% 1/16W 0603 - 0603 Surface Mount Package 0 Ohm 1/10 Watt 1% Resistor 15 Ohm 1/10 Watt 1% Resistor 33 Ohm 1/10 Watt 1% Resistor 49.9 Ohm 1/10 Watt 1% Resistor 100 Ohm 1/10 Watt 1% Resistor 150 Ohm 1/10 Watt 1% Resistor 240 Ohm 1/10 Watt 1% Resistor 390 Ohm 1/10 Watt 1% Resistor 560 Ohm 1/10 Watt 1% Resistor 680 Ohm 1/10 Watt 1% Resistor 750 Ohm 1/10 Watt 1% Resistor 1.0K Ohm 1/10 Watt 1% Resistor 1.5K Ohm 1/10 Watt 1% Resistor 2.0K Ohm 1/10 Watt 1% Resistor 2.2K Ohm 1/10 Watt 1% Resistor 3.3K Ohm 1/10 Watt 1% Resistor 4.7K Ohm 1/10 Watt 1% Resistor 10.0K Ohm 1/10 Watt 1% Resistor 12.0K Ohm 1/10 Watt 1% Resistor 12.1K Ohm 1/10 Watt 1% Resistor 20.0K Ohm 1/10 Watt 1% Resistor 33.0K Ohm 1/10 Watt 1% Resistor 100.0K Ohm 1/10 Watt 1% Resistor 0805 - 0805 Surface Mount Package 0 Ohm 1/8 Watt 1% Resistor 33 Ohm 1/8 Watt 1% Resistor 100 Ohm 1/8 Watt 1% Resistor 150 Ohm 1/8 Watt 1% Resistor 200 Ohm 1/8 Watt 1% Resistor 240 Ohm 1/8 Watt 1% Resistor 330 Ohm 1/8 Watt 1% Resistor 390 Ohm 1/8 Watt 1% Resistor 470 Ohm 1/8 Watt 1% Resistor 1.0K Ohm 1/8 Watt 1% Resistor 1.5K Ohm 1/8 Watt 1% Resistor 2.0K Ohm 1/8 Watt 1% Resistor 4.7K Ohm 1/8 Watt 1% Resistor 5.1K Ohm 1/8 Watt 1% Resistor 5.6K Ohm 1/8 Watt 1% Resistor 10.0K Ohm 1/8 Watt 1% Resistor 22.0K Ohm 1/8 Watt 1% Resistor 33.0K Ohm 1/8 Watt 1% Resistor 100K Ohm 1/8 Watt 1% Resistor 1206 - 1206 Surface Mount Package 2012 - 2010 Surface Mount Package 0.11 Ohm 1/2 Watt 1% Resistor - Digikey: RHM.11UCT-ND; MPN: CPF0402B2K0E1
R6 R11 = microbuilder:RESISTOR: Resistors 0402 - 0402 Surface Mount Package 22 Ohm 1% 1/16W [Digikey: 311-22.0LRTR-ND] 33 Ohm 5% 1/16W 1.0K 5% 1/16W 1.5K 5% 1/16W 2.0K 1% 1/16W 10.0K 1% 1/16W [Digikey: 311-10.0KLRTR-ND] 10.0K 5% 1/16W [Digikey: RMCF0402JT10K0TR-ND] 12.1K 1% 1/16W [Digikey: 311-22.0LRTR-ND] 100.0K 5% 1/16W 0603 - 0603 Surface Mount Package 0 Ohm 1/10 Watt 1% Resistor 15 Ohm 1/10 Watt 1% Resistor 33 Ohm 1/10 Watt 1% Resistor 49.9 Ohm 1/10 Watt 1% Resistor 100 Ohm 1/10 Watt 1% Resistor 150 Ohm 1/10 Watt 1% Resistor 240 Ohm 1/10 Watt 1% Resistor 390 Ohm 1/10 Watt 1% Resistor 560 Ohm 1/10 Watt 1% Resistor 680 Ohm 1/10 Watt 1% Resistor 750 Ohm 1/10 Watt 1% Resistor 1.0K Ohm 1/10 Watt 1% Resistor 1.5K Ohm 1/10 Watt 1% Resistor 2.0K Ohm 1/10 Watt 1% Resistor 2.2K Ohm 1/10 Watt 1% Resistor 3.3K Ohm 1/10 Watt 1% Resistor 4.7K Ohm 1/10 Watt 1% Resistor 10.0K Ohm 1/10 Watt 1% Resistor 12.0K Ohm 1/10 Watt 1% Resistor 12.1K Ohm 1/10 Watt 1% Resistor 20.0K Ohm 1/10 Watt 1% Resistor 33.0K Ohm 1/10 Watt 1% Resistor 100.0K Ohm 1/10 Watt 1% Resistor 0805 - 0805 Surface Mount Package 0 Ohm 1/8 Watt 1% Resistor 33 Ohm 1/8 Watt 1% Resistor 100 Ohm 1/8 Watt 1% Resistor 150 Ohm 1/8 Watt 1% Resistor 200 Ohm 1/8 Watt 1% Resistor 240 Ohm 1/8 Watt 1% Resistor 330 Ohm 1/8 Watt 1% Resistor 390 Ohm 1/8 Watt 1% Resistor 470 Ohm 1/8 Watt 1% Resistor 1.0K Ohm 1/8 Watt 1% Resistor 1.5K Ohm 1/8 Watt 1% Resistor 2.0K Ohm 1/8 Watt 1% Resistor 4.7K Ohm 1/8 Watt 1% Resistor 5.1K Ohm 1/8 Watt 1% Resistor 5.6K Ohm 1/8 Watt 1% Resistor 10.0K Ohm 1/8 Watt 1% Resistor 22.0K Ohm 1/8 Watt 1% Resistor 33.0K Ohm 1/8 Watt 1% Resistor 100K Ohm 1/8 Watt 1% Resistor 1206 - 1206 Surface Mount Package 2012 - 2010 Surface Mount Package 0.11 Ohm 1/2 Watt 1% Resistor - Digikey: RHM.11UCT-ND; MPN: CRCW040210K0FKED
R7-R10 = microbuilder:RESISTOR: Resistors 0402 - 0402 Surface Mount Package 22 Ohm 1% 1/16W [Digikey: 311-22.0LRTR-ND] 33 Ohm 5% 1/16W 1.0K 5% 1/16W 1.5K 5% 1/16W 2.0K 1% 1/16W 10.0K 1% 1/16W [Digikey: 311-10.0KLRTR-ND] 10.0K 5% 1/16W [Digikey: RMCF0402JT10K0TR-ND] 12.1K 1% 1/16W [Digikey: 311-22.0LRTR-ND] 100.0K 5% 1/16W 0603 - 0603 Surface Mount Package 0 Ohm 1/10 Watt 1% Resistor 15 Ohm 1/10 Watt 1% Resistor 33 Ohm 1/10 Watt 1% Resistor 49.9 Ohm 1/10 Watt 1% Resistor 100 Ohm 1/10 Watt 1% Resistor 150 Ohm 1/10 Watt 1% Resistor 240 Ohm 1/10 Watt 1% Resistor 390 Ohm 1/10 Watt 1% Resistor 560 Ohm 1/10 Watt 1% Resistor 680 Ohm 1/10 Watt 1% Resistor 750 Ohm 1/10 Watt 1% Resistor 1.0K Ohm 1/10 Watt 1% Resistor 1.5K Ohm 1/10 Watt 1% Resistor 2.0K Ohm 1/10 Watt 1% Resistor 2.2K Ohm 1/10 Watt 1% Resistor 3.3K Ohm 1/10 Watt 1% Resistor 4.7K Ohm 1/10 Watt 1% Resistor 10.0K Ohm 1/10 Watt 1% Resistor 12.0K Ohm 1/10 Watt 1% Resistor 12.1K Ohm 1/10 Watt 1% Resistor 20.0K Ohm 1/10 Watt 1% Resistor 33.0K Ohm 1/10 Watt 1% Resistor 100.0K Ohm 1/10 Watt 1% Resistor 0805 - 0805 Surface Mount Package 0 Ohm 1/8 Watt 1% Resistor 33 Ohm 1/8 Watt 1% Resistor 100 Ohm 1/8 Watt 1% Resistor 150 Ohm 1/8 Watt 1% Resistor 200 Ohm 1/8 Watt 1% Resistor 240 Ohm 1/8 Watt 1% Resistor 330 Ohm 1/8 Watt 1% Resistor 390 Ohm 1/8 Watt 1% Resistor 470 Ohm 1/8 Watt 1% Resistor 1.0K Ohm 1/8 Watt 1% Resistor 1.5K Ohm 1/8 Watt 1% Resistor 2.0K Ohm 1/8 Watt 1% Resistor 4.7K Ohm 1/8 Watt 1% Resistor 5.1K Ohm 1/8 Watt 1% Resistor 5.6K Ohm 1/8 Watt 1% Resistor 10.0K Ohm 1/8 Watt 1% Resistor 22.0K Ohm 1/8 Watt 1% Resistor 33.0K Ohm 1/8 Watt 1% Resistor 100K Ohm 1/8 Watt 1% Resistor 1206 - 1206 Surface Mount Package 2012 - 2010 Surface Mount Package 0.11 Ohm 1/2 Watt 1% Resistor - Digikey: RHM.11UCT-ND; MPN: CPF0402B100RE1
RGB1 = osram_opto_LED:LRTB_R48G: OSRAM RGB LED; MPN: LRTB R48G
SJ1-SJ3 = microbuilder:SOLDERJUMPER: SMD Solder JUMPER Solder the two pads together to create a connection, or remove the solder to break it. REFLOW - Use this footprint for solder paste and reflow ovens. WAVE - Use this footprint for hand-soldering (larger pads). CLOSED - Has a trace between the two pads to ensure it is closed by default. The trace needs to be cut to disable the jumper, and can be closed again by creating a solder bridge between the two pads.
SPI = microbuilder:HEADER-1X7: PIN HEADER
SW_BATTMODE SWCHARGE SWPOWER = microbuilder:SWITCH_SPDT: Switch - SPDT SSSS811101 - Horizontal Two Position SMT, 0.3A 4V [Mouser: 688-SSSS811101]; MPN: SSSS811101
TP3-TP6 = microbuilder:TESTPOINT: Test Point Various test points for characterisation and PCB testing TESTPOINT_SMT - Compact Surface Mount Test Point [Digikey: 5016KTR-ND]
UART = microbuilder:HEADER-1X4: PIN HEADER

## Board
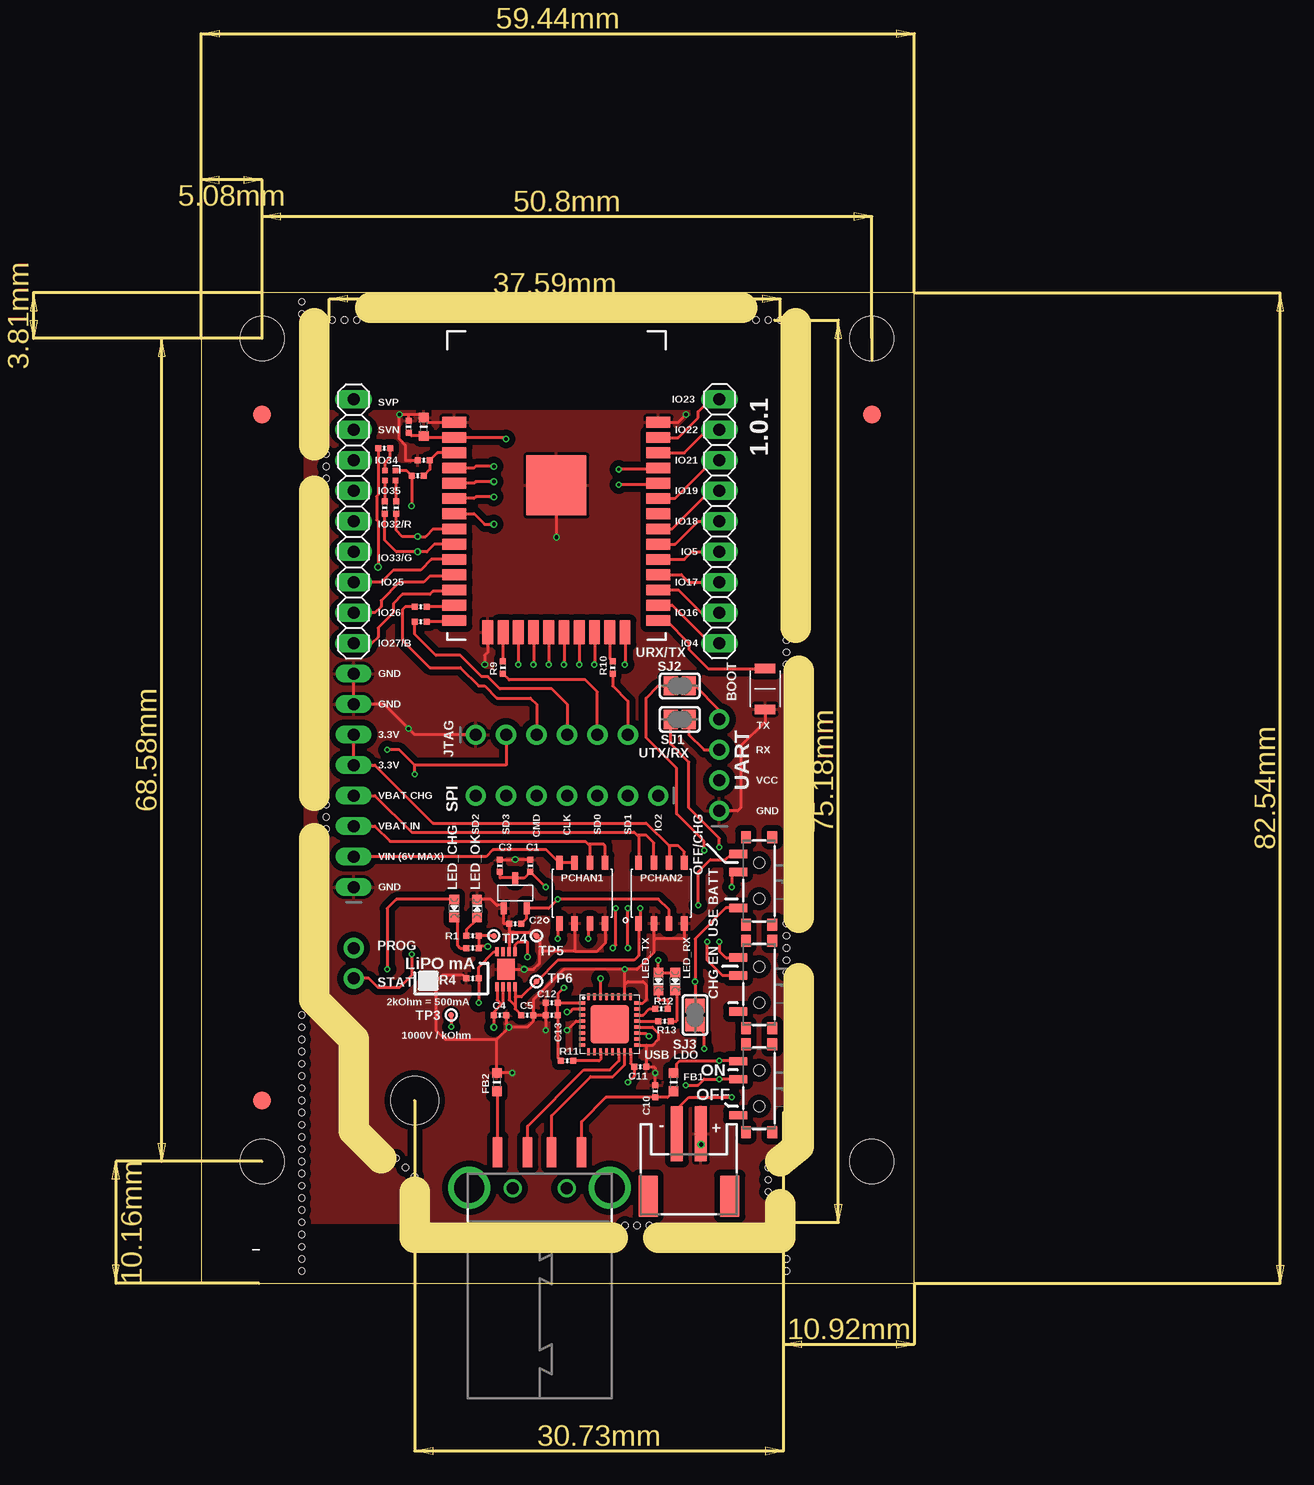
[diagram p7: board, top side]
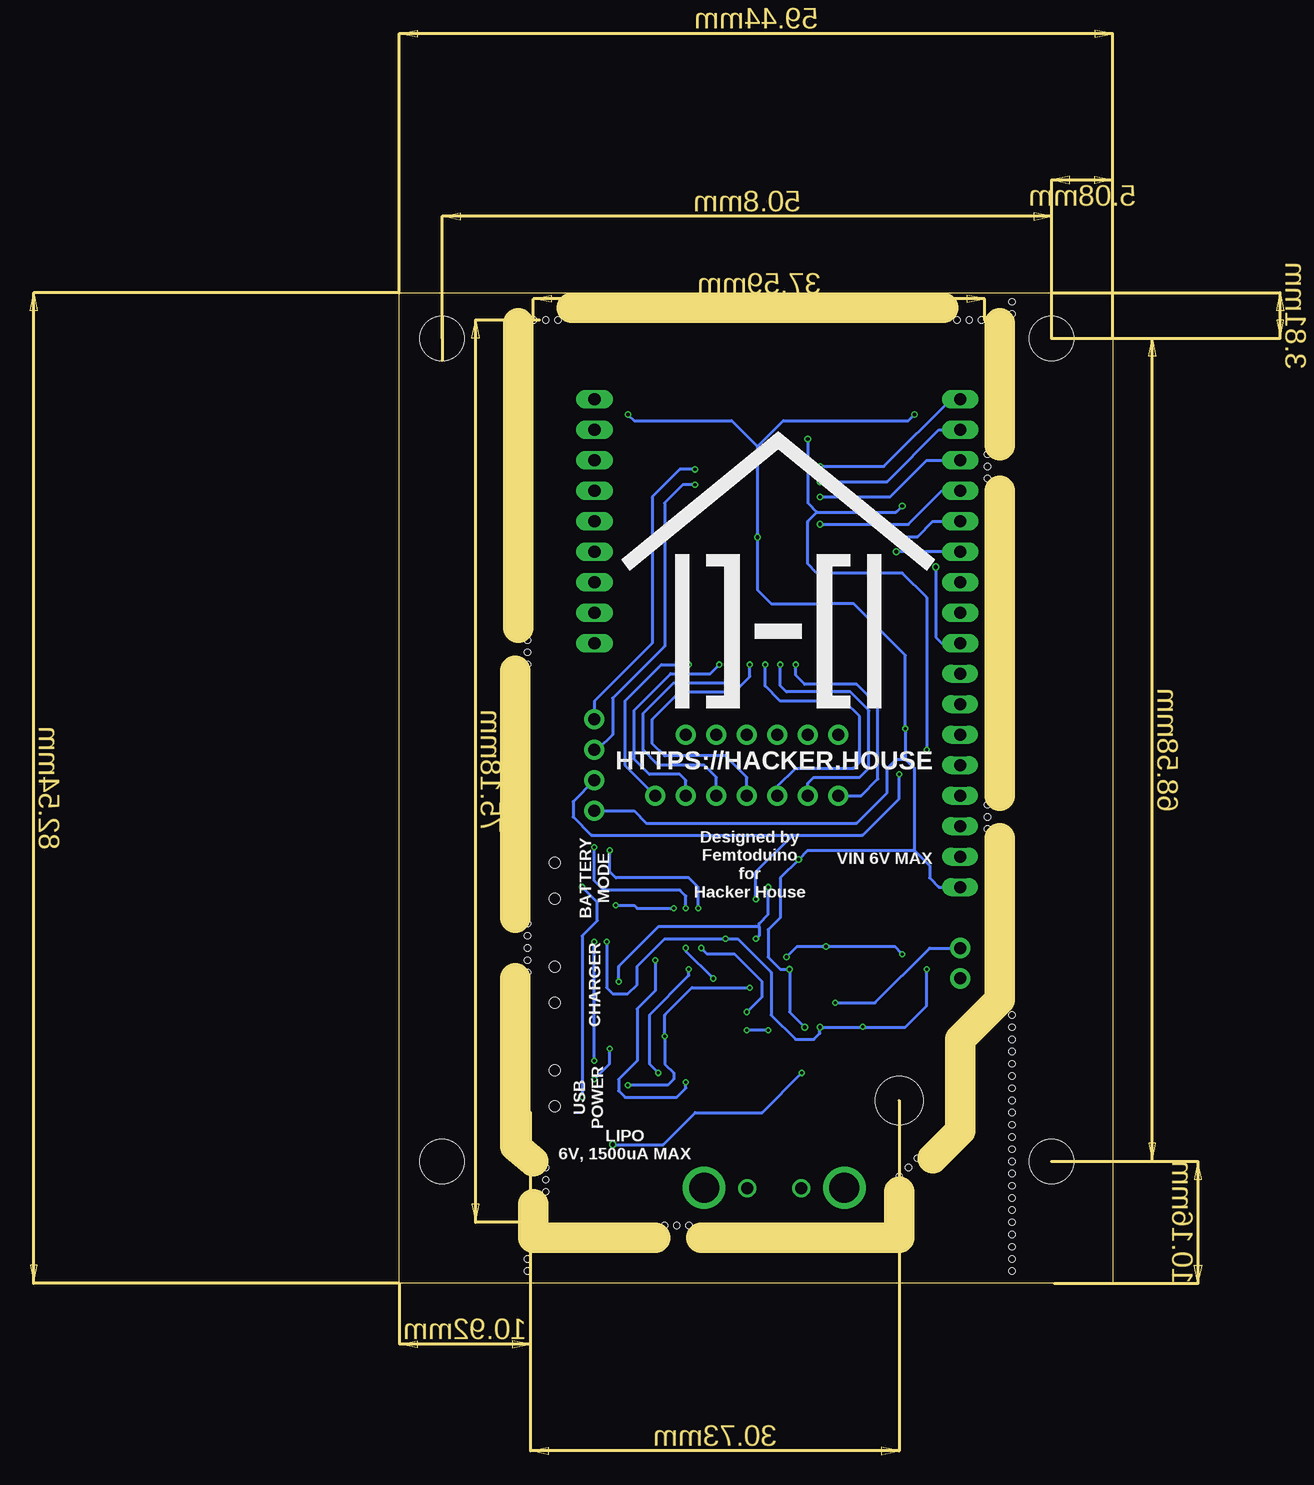
[diagram p8: board, bottom side, seen from below]

Size 59.44 x 82.54 mm. Coordinates in mm from the lower left corner, seen from the top.
Outline: 0,0 59.44,0 59.44,82.54 0,82.54 0,0
Copper layers (1*16): Top 0.035559375mm / dielectric 1.6mm / Bottom 0.035559375mm
Design rules "oshpark-2layer *": minimum track width 6mil, minimum drill 10mil, track to track 6mil, track to pad 6mil, pad to pad 6mil, via to via 6mil, smd to smd 6mil, copper to edge 15mil, drill to drill 6mil, minimum pad ring 5mil, minimum via ring 5mil, stop-mask expansion 2.5mil, vias tented up to drill 12mil, thermal gap 10mil
Holes 3.68 mm at 5.08,78.74 5.08,10.16 55.88,78.74 55.88,10.16
Holes 4 mm at 17.78,15.24
Holes 0.51 mm at 10.92,80.26 11.94,80.26 12.95,80.26 48.26,80.26 47.24,80.26 46.23,80.26 47.24,7.62 47.24,8.64 47.24,9.65 48.77,25.91 48.77,26.92 48.77,27.94 48.77,28.96 48.77,29.97 48.77,51.56 48.77,52.58 48.77,53.59 10.41,69.09 10.41,68.07 10.41,67.06 10.41,39.88 10.41,38.86 10.41,37.85 16.26,10.41 17.02,9.65 17.78,8.89 37.34,4.83 36.32,4.83 35.31,4.83 8.38,80.77 8.38,81.79 8.38,22.35 8.38,21.34 8.38,20.32 8.38,19.3 8.38,18.29 8.38,17.27 8.38,16.26 8.38,15.24 8.38,14.22 8.38,13.21 8.38,12.19 8.38,11.18 8.38,10.16 8.38,9.14 8.38,8.13 8.38,7.11 8.38,6.1 8.38,5.08 8.38,4.06 8.38,3.05 8.38,2.03 8.38,1.02 48.77,1.02 48.77,2.03
Milling: 15 lines

### Footprints (pad centres in the part's own frame; a part is rotated, then mirrored left to right if it is on the bottom)
SIDE_ACT_NO_GND_NO_BOSS = smd 0.8 x 1.7: 1 -1.7,0; 2 1.7,0
_0402MP = smd 0.5 x 0.5: 1 -0.508,0; 2 0.508,0
_0603MP = smd 0.8 x 0.8: 1 -0.762,0; 2 0.762,0
USB_A-SMT = drill 2.5 pad 3.302: D1 -5.85,2.958; D2 5.85,2.958 | drill 1: D3 -2.25,3; D4 2.25,3 | smd 0.8 x 2.5: D+ 1,0; D- -1,0; GND 3.5,0; VBUS -3.5,0
JSTPH2 = smd 1 x 4.6: 1 -1,-3.7; 2 1,-3.7 | smd 1.6 x 3.4: NC1 -3.4,1.5; NC2 3.4,1.5
FIDUCIAL_1MM = smd 1.5 x 1.5: 1 0,0
QFN32 = smd 0.6 x 0.3: 1 -2.3,1.75; 2 -2.3,1.25; 3 -2.3,0.75; 4 -2.3,0.25; 5 -2.3,-0.25; 6 -2.3,-0.75; 7 -2.3,-1.25; 8 -2.3,-1.75; 17 2.3,-1.75; 18 2.3,-1.25; 19 2.3,-0.75; 20 2.3,-0.25; 21 2.3,0.25; 22 2.3,0.75; 23 2.3,1.25; 24 2.3,1.75 | smd 0.3 x 0.6: 9 -1.75,-2.3; 10 -1.25,-2.3; 11 -0.75,-2.3; 12 -0.25,-2.3; 13 0.25,-2.3; 14 0.75,-2.3; 15 1.25,-2.3; 16 1.75,-2.3; 25 1.75,2.3; 26 1.25,2.3; 27 0.75,2.3; 28 0.25,2.3; 29 -0.25,2.3; 30 -0.75,2.3; 31 -1.25,2.3; 32 -1.75,2.3 | smd 3.2 x 3.2: EXP 0,0
1X09 = drill 1.016 long: 1 -10.16,0; 2 -7.62,0; 3 -5.08,0; 4 -2.54,0; 5 0,0; 6 2.54,0; 7 5.08,0; 8 7.62,0; 9 10.16,0
1X06 = drill 1.016 long: 1 -6.35,0; 2 -3.81,0; 3 -1.27,0; 4 1.27,0; 5 3.81,0; 6 6.35,0
1X03 = drill 1.016 long: 1 -2.54,0; 2 0,0; 3 2.54,0
1X06_ROUND = drill 1 pad 1.676: 1 -6.35,0; 2 -3.81,0; 3 -1.27,0; 4 1.27,0; 5 3.81,0; 6 6.35,0
MCP1700T-3302E/TT = smd 0.5 x 1: GND -0.95,-1.25; VIN 0,1.25; VOUT 0.95,-1.25
CHIPLED_0603_NOOUTLINE = smd 0.8 x 0.8: A 0,-0.75; C 0,0.75
2X3_DFN = smd 0.3 x 0.75: 1 -0.75,-1.45; 2 -0.25,-1.45; 3 0.25,-1.45; 4 0.75,-1.45; 5 0.75,1.45; 6 0.25,1.45; 7 -0.25,1.45; 8 -0.75,1.45 | smd 1.45 x 1.75: 9 0,0
ESP32-WROOM-32-MODULE = smd 2 x 0.9: 1 -8.5,5.26; 2 -8.5,3.99; 3 -8.5,2.72; 4 -8.5,1.45; 5 -8.5,0.18; 6 -8.5,-1.09; 7 -8.5,-2.36; 8 -8.5,-3.63; 9 -8.5,-4.9; 10 -8.5,-6.17; 11 -8.5,-7.44; 12 -8.5,-8.71; 13 -8.5,-9.98; 14 -8.5,-11.25; 25 8.5,-11.25; 26 8.5,-9.98; 27 8.5,-8.71; 28 8.5,-7.44; 29 8.5,-6.17; 30 8.5,-4.9; 31 8.5,-3.63; 32 8.5,-2.36; 33 8.5,-1.09; 34 8.5,0.18; 35 8.5,1.45; 36 8.5,2.72; 37 8.5,3.99; 38 8.5,5.26 | smd 0.9 x 2: 15 -5.715,-12.25; 16 -4.445,-12.25; 17 -3.175,-12.25; 18 -1.905,-12.25; 19 -0.635,-12.25; 20 0.635,-12.25; 21 1.905,-12.25; 22 3.175,-12.25; 23 4.445,-12.25; 24 5.715,-12.25 | smd 5 x 5: GND 0,0
SO-8 = smd 0.559 x 1.194: 1 -1.905,-2.527; 2 -0.635,-2.527; 3 0.635,-2.527; 4 1.905,-2.527; 5 1.905,2.527; 6 0.635,2.527; 7 -0.635,2.527; 8 -1.905,2.527
1X08_OVAL = drill 1 long: 1 -8.89,0; 2 -6.35,0; 3 -3.81,0; 4 -1.27,0; 5 1.27,0; 6 3.81,0; 7 6.35,0; 8 8.89,0
1X01_ROUND = drill 1 pad 1.676: 1 0,0
LRTB_R48G = smd 0.45 x 0.45: 1 0.425,0.425; 2 0.425,-0.425; 3 -0.425,-0.425; 4 -0.425,0.425
SOLDERJUMPER_CLOSEDWIRE = smd 1.168 x 1.6: 1 -0.762,0; 2 0.762,0 | smd 0.635 x 0.203: WIRE 0,0
1X07_ROUND = drill 1 pad 1.676: 1 -7.62,0; 2 -5.08,0; 3 -2.54,0; 4 0,0; 5 2.54,0; 6 5.08,0; 7 7.62,0
SPDT_SMT_SSSS811101 = smd 0.7 x 1.5: A -2.25,1.75; B 0.75,1.75; C 2.25,1.75 | smd 1 x 0.8: SUP1 -3.65,1.1; SUP2 -3.65,-1.1; SUP3 3.65,1.1; SUP4 3.65,-1.1 | hole 0.9: -1.5,0; 1.5,0
TESTPOINT_ROUND_0.5MM = smd 0.5 x 0.5: P$1 0,0
1X04_ROUND = drill 1 pad 1.676: 1 -3.81,0; 2 -1.27,0; 3 1.27,0; 4 3.81,0

### Placement (x,y rotation side)
BOOT  46.99,49.53 270 top
C1  27.43,34.8 90 top
C2  26.16,29.97 180 top
C3  24.89,34.8 90 top
C4  24.89,22.35 0 top
C5  27.18,22.35 0 top
C7  18.54,71.37 270 top
C8  17.27,71.37 270 top
C9  18.54,68.58 0 top
C10  37.85,16 270 top
C11  36.58,18.03 180 top
C12  29.21,23.37 0 top
C13  29.21,22.35 0 top
CN1  28.19,10.92 180 top
CN_BATT_CHARGE  40.64,8.76 180 top
FB1  39.37,16.76 90 top
FB2  24.64,16.76 90 top
FID1  5.08,15.24 0 top
FID2  5.08,72.39 0 top
FID3  55.88,72.39 0 top
IC1  34.04,21.59 0 top
JP1  12.7,63.5 90 top
JP3  43.18,59.69 270 top
JP4  43.18,71.12 270 top
JTAG  29.21,45.72 0 top
LDO1  26.16,32.51 0 top
LED_CHG  21.08,31.24 180 top
LED_OK  22.99,31.24 0 top
LED_RX  39.5,25.15 180 top
LED_TX  38.1,25.15 180 top
LIPO1  25.4,26.16 0 top
MOD1  29.6,66.49 0 top
PCHAN1  31.75,32.51 0 top
PCHAN2  38.35,32.51 0 top
POWER  12.7,41.91 90 top
PROG  12.7,27.94 0 top
R1  22.61,28.96 0 top
R2  22.61,27.94 0 top
R4  22.61,25.4 180 top
R6  18.03,67.31 180 top
R7  18.29,56.39 0 top
R8  18.29,55.12 0 top
R9  25.15,51.31 90 top
R10  34.29,51.31 90 top
R11  30.48,18.54 0 top
R12  38.35,22.86 0 top
R13  38.61,21.84 0 top
R14  16.26,64.64 90 top
R15  15.3,64.64 90 top
R16  15.24,69.6 0 top
RGB1  15.75,67.31 0 top
SJ1  39.88,46.99 0 top
SJ2  39.88,49.78 0 top
SJ3  41.15,22.35 90 top
SPI  30.48,40.64 180 top
STAT  12.7,25.4 0 top
SW_BATTMODE  46.48,33.53 90 top
SWCHARGE  46.48,24.89 90 top
SWPOWER  46.48,16.26 90 top
TP3  20.83,22.35 0 top
TP4  24.38,28.96 0 top
TP5  27.94,28.96 0 top
TP6  27.94,25.15 0 top
UART  43.18,43.18 90 top

### Tracks (layer width: path | path; a pad name or v marks a point on that pad's centre or on a via)
3.3V  (via drill 0.25 pad 0.51)
  Top 0.254: LED_RX.A LED_TX.A v38.1,26.92 | IC1.16 35.79,18.32 C11.2 36.07,17.27 v35.56,16.76
  Bottom 0.254: v38.1,26.92 38.1,24.38 39.62,22.86 39.62,18.53 41.17,16.98 41.17,16.04 40.63,15.49 36.32,15.49 35.56,16.26 v35.56,16.76
BOOT
  Top 0.254: MOD1.25 38.74,55.24 40.64,53.34 40.64,52.83 42.24,51.23 BOOT.1
CLK  (via drill 0.25 pad 0.51)
  Top 0.254: MOD1.20 v30.23,51.57 v30.23,51.56
  Bottom 0.254: SPI.4 30.48,42.16 32.26,43.94 37.34,43.94 38.35,44.96 38.35,46.99 36.07,49.28 31.5,49.28 30.23,50.55 v30.23,51.56
CMD  (via drill 0.25 pad 0.51)
  Top 0.254: MOD1.19 v28.96,51.56
  Bottom 0.254: SPI.5 27.94,41.4 26.42,42.93 21.59,42.93 21.08,43.43 21.08,47.24 22.35,48.51 27.69,48.51 28.96,49.78 v28.96,51.56
EN
  Top 0.254: MOD1.3 19.68,69.21 C9.2 19.05,67.82 R6.1
GND  (via drill 0.25 pad 0.51, 0.3 pad 0.51, 0.35)
  Top 0.254: C9.1 17.02,68.58 17.02,69.85 16.51,70.36 v16.51,72.39 17.27,72.39 | MOD1.15 23.89,52.59 23.62,52.32 v23.62,51.56 | C3.2 v26.16,35.31 C1.2 | MOD1.38 39.75,71.75 v40.39,72.39 | MOD1.1 18.93,71.75 C7.1 18.29,72.39 17.27,72.39 | 25.65,29.21 C2.2 25.21,29.97 LDO1.GND 24.98,31.5 24.63,31.5 24.13,31.99 LED_OK.C | 25.65,29.21 27.69,29.21 TP5.P$1 28.19,28.7 28.19,27.69 | C4.2 25.4,21.59 v25.65,21.34 | C5.2 27.69,21.84 27.18,21.34 v25.65,21.34 | 24.64,20.32 v25.65,21.34 | R4.2 21.84,25.65 20.07,25.65 19.56,25.15 19.56,21.08 20.32,20.32 24.64,20.32 | C8.1 17.27,72.39 | LIPO1.9 v26.92,26.16 27.69,26.16 28.19,26.67 28.19,27.69 | 25.65,29.21 25.65,28.38 25.65,28.37 LIPO1.6 | PCHAN1.2 31.11,27.69 | 31.11,27.69 28.19,27.69 | 31.11,27.69 33.02,27.69 33.66,28.32 PCHAN1.4 | PCHAN2.2 37.72,28.57 | 37.72,28.57 37.72,27.56 36.32,26.16 v35.31,26.16 | v35.31,26.16 30.23,26.16 27.69,23.62 C5.2 | 37.72,28.57 37.85,28.7 40.26,28.7 PCHAN2.4 | C12.1 C13.1 | IC1.4 31.24,21.84 v30.48,21.08 | C10.1 v37.85,17.53 37.85,17.91 37.72,18.03 C11.1 37.08,19.81 37.11,19.84 | 24.64,20.32 FB2.2 v25.91,17.53 | IC1.24 36.8,23.34 37.08,23.62 37.08,24.89 36.83,25.15 35.56,25.15 35.29,24.87 | IC1.20 37.59,21.34 38.1,20.83 38.1,20.32 37.62,19.84 37.11,19.84 | IC1.17 37.11,19.84 | IC1.26 35.29,24.87 | C13.1 v28.7,21.08 | C13.1 C5.2 | 35.29,24.87 35.29,26.14 v35.31,26.16 | MOD1.GND v29.6,62.17 | BOOT.2 46.99,46.81 44.96,44.78 44.96,39.62 44.7,39.37 UART.1 | POWER.8 POWER.7 15.24,48.26 v17.27,46.23 17.78,45.72 JTAG.1 | CN_BATT_CHARGE.1 41.66,12.45 v41.66,11.56
  Bottom 0.254: 23.62,56.64 28.45,56.64 29.6,57.79 v29.6,62.17 29.6,69.71 | 23.62,56.64 v23.62,51.56 | v40.39,72.39 39.88,71.88 31.75,71.88 29.6,69.73 29.6,69.71 | v16.51,72.39 17.02,71.88 27.43,71.88 29.6,69.71 | 16.51,36.07 25.4,36.07 v26.16,35.31 27.69,33.78 27.69,30.48 28.7,29.46 28.7,27.18 27.69,26.16 v26.92,26.16 26.92,22.61 v25.65,21.34 | 17.27,43.69 v17.27,46.23 17.27,52.32 21.59,56.64 23.62,56.64 | 17.27,43.69 16.51,42.93 16.51,36.07 | 16.51,36.07 15.24,34.8 15.24,33.78 14.48,33.02 POWER.1 | v37.85,17.53 38.61,18.29 38.61,22.35 35.31,25.65 v35.31,26.16 | v28.7,21.08 v30.48,21.08 | UART.1 39.88,39.37 38.86,38.35 21.34,38.35 18.8,40.89 18.8,42.93 18.03,43.69 17.27,43.69 | v25.91,17.53 29.21,14.22 34.8,14.22 37.47,11.56 v41.66,11.56
  pour Top (isolate 0.508): 8.64,5.08 48.77,5.08 48.77,72.64 8.64,72.64
GND_
  Top 0.254: CN1.GND 24.69,15.95 FB2.1
IO2  (via drill 0.25 pad 0.51)
  Top 0.254: MOD1.24 v35.31,51.57 v35.31,51.56
  Bottom 0.254: v35.31,51.56 37.59,51.56 40.64,48.51 40.64,43.18 SPI.1
IO4
  Top 0.254: MOD1.26 39.25,56.51 42.42,53.34 JP3.6
IO5
  Top 0.254: MOD1.29 40.25,60.32 40.89,60.96 JP3.3
IO16
  Top 0.254: MOD1.27 39.76,57.78 41.66,55.88 JP3.5
IO17
  Top 0.254: MOD1.28 40.01,59.05 40.64,58.42 JP3.4
IO18
  Top 0.254: MOD1.30 39.49,61.59 41.4,63.5 JP3.2
IO19
  Top 0.254: MOD1.31 39.24,62.86 42.42,66.04 JP3.1
IO21
  Top 0.254: MOD1.33 39.49,65.4 42.67,68.58 JP4.3
IO22
  Top 0.254: MOD1.36 40.25,69.21 42.16,71.12 JP4.2
IO23
  Top 0.254: MOD1.37 39.75,70.48 41.4,72.14 41.4,72.64 42.42,73.66 JP4.1
IO25
  Top 0.254: MOD1.10 19.17,60.32 18.29,59.44 16,59.44 14.99,58.42 JP1.3
IO26
  Top 0.254: MOD1.11 20.98,58.93 19.05,58.93 18.54,58.42 16.51,58.42 14.99,56.9 14.99,56.39 14.48,55.88 JP1.2
IO27/BLUE  (via drill 0.35)
  Top 0.254: MOD1.12 20.98,57.66 19.3,57.66 19.05,57.4 16.76,57.4 16,56.64 16,55.88 14.73,54.61 14.73,53.85 14.22,53.34 JP1.1 | R16.1 14.73,65.69 14.62,65.58 14.62,63.62 14.73,63.51 v14.73,59.69
  Bottom 0.254: v14.73,59.69 14.73,53.85 14.22,53.34 JP1.1
IO32/RED  (via drill 0.3 pad 0.51)
  Top 0.254: R14.1 16.26,62.74 16.76,62.23 v18.03,62.23 18.69,62.23 19.32,62.86 MOD1.8
  Bottom 0.254: v18.03,62.23 16.26,62.23 14.99,63.5 JP1.5
IO33/GREEN  (via drill 0.3 pad 0.51)
  Top 0.254: MOD1.9 19.43,61.59 18.8,60.96 v18.03,60.96 16.26,60.96 15.3,61.91 R15.1
  Bottom 0.254: JP1.4 v18.03,60.96
IO34  (via drill 0.3 pad 0.51)
  Top 0.254: v24.38,65.53 22.86,65.53 22.73,65.4 MOD1.6
  Bottom 0.254: v24.38,65.53 18.54,65.53 15.49,68.58 JP1.7
IO35  (via drill 0.3 pad 0.51)
  Top 0.254: MOD1.7 22.74,64.13 23.62,63.25 v24.38,63.25
  Bottom 0.254: v24.38,63.25 17.02,63.25 14.22,66.04 JP1.6
MTCK
  Top 0.254: R9.1 25.65,50.29 32,50.29 33.02,49.28 JTAG.5
MTDI
  Top 0.254: R8.1 17.78,54.1 19.56,52.32 21.59,52.32 23.37,50.55 23.88,50.55 24.89,49.53 29.21,49.53 30.48,48.26 JTAG.4
MTDI_
  Top 0.254: MOD1.14 20.98,55.12 R8.2
MTDO
  Top 0.254: R10.1 34.29,49.78 35.56,48.51 JTAG.6
MTMS
  Top 0.254: R7.1 17.02,56.39 16.76,56.13 16.76,53.59 19.05,51.31 21.59,51.31 23.11,49.78 23.62,49.78 24.64,48.77 27.43,48.77 27.94,48.26 JTAG.3
N$1
  Top 0.254: PCHAN1.7 PCHAN1.8 28.77,36.12 24.3,36.12 23.74,35.56 POWER.2
N$4
  Top 0.254: LED_TX.C 38.1,23.63 38.86,23.63 R12.2
N$5
  Top 0.254: R13.2 39.62,21.84 39.62,24.27 LED_RX.C
N$6
  Top 0.254: RGB1.4 15.32,68.41 15.75,68.83 R16.2
N$7
  Top 0.254: MOD1.13 20.98,56.39 R7.2
N$8
  Top 0.254: RGB1.3 15.3,66.86 R15.2
N$9
  Top 0.254: LED_OK.A 22.99,30.35 22.1,29.46 R1.1
N$10
  Top 0.254: LED_CHG.C 21.34,30.24 21.34,28.19 21.59,27.94 R2.1
N$11
  Top 0.254: R14.2 16.26,66.8 RGB1.2
N$14
  Top 0.254: POWER.3 14.48,38.1 15.75,36.83 32,36.83 32.26,36.58 | 32.26,36.58 32.38,36.45 PCHAN1.6 | PCHAN1.5 33.66,36.45 33.53,36.58 32.26,36.58
N$15
  Top 0.254: POWER.4 14.48,40.64 17.53,37.59 36.07,37.59 36.32,37.34 | 36.32,37.34 36.45,37.21 PCHAN2.8 | PCHAN2.7 37.72,36.7 37.08,37.34 36.32,37.34
N$16
  Top 0.254: 38.99,36.45 37.08,38.35 19.3,38.35 14.48,43.18 POWER.5 POWER.6 | 38.99,36.45 PCHAN2.6 | PCHAN2.5 40.26,35.94 39.75,36.45 38.99,36.45
N$18
  Top 0.254: MOD1.16 25.15,54.23 R9.2
N$19
  Top 0.254: MOD1.23 34.05,52.06 R10.2
PROG  (via drill 0.25 pad 0.51)
  Top 0.254: LIPO1.8 24.4,27.61 23.11,26.33 R4.1 v23.11,23.37
  Bottom 0.254: v23.11,23.37 19.81,23.37 15.24,27.94 PROG.1
PWREN#
  Top 0.254: IC1.11 33.29,18.66 33.16,18.53 31,18.53 R11.2
RX  (via drill 0.25 pad 0.51)
  Top 0.254: MOD1.34 37.98,66.55 v34.8,66.55 | SJ1.2 40.64,45.72 41.91,44.45 UART.3
  Bottom 0.254: v34.8,66.55 35.81,66.55 37.34,65.02 37.34,53.09 41.66,48.77 41.66,45.72 42.93,44.45 UART.3
RXLED#
  Top 0.254: IC1.21 R13.1
SD0  (via drill 0.25 pad 0.51)
  Top 0.254: MOD1.21 v31.5,51.57 v31.5,51.56
  Bottom 0.254: SPI.3 33.02,42.16 34.04,43.18 37.85,43.18 39.12,44.45 39.12,47.5 36.58,50.04 32,50.04 31.5,50.55 v31.5,51.56
SD1  (via drill 0.25 pad 0.51)
  Top 0.254: MOD1.22 v32.77,51.57 v32.77,51.56
  Bottom 0.254: SPI.2 35.56,41.91 36.07,42.42 38.61,42.42 39.88,43.69 39.88,47.75 36.83,50.8 33.53,50.8 v32.77,51.56
SD2  (via drill 0.25 pad 0.51)
  Top 0.254: MOD1.17 26.42,54.23 v26.42,51.56
  Bottom 0.254: SPI.7 20.95,40.64 19.56,42.04 19.56,48.13 21.34,49.91 25.65,49.91 26.42,50.67 v26.42,51.56
SD3  (via drill 0.25 pad 0.51)
  Top 0.254: MOD1.18 v27.7,51.57 v27.69,51.56
  Bottom 0.254: SPI.6 25.4,41.66 24.89,42.16 21.08,42.16 20.32,42.93 20.32,47.75 21.84,49.28 27.18,49.28 27.69,49.78 v27.69,51.56
SEN_VN  (via drill 0.3 pad 0.51)
  Top 0.254: v24.38,66.8 22.86,66.8 22.73,66.67 MOD1.5
  Bottom 0.254: v24.38,66.8 18.8,66.8 14.48,71.12 JP1.8
SEN_VP  (via drill 0.3 pad 0.51)
  Top 0.254: v24.38,68.07 22.86,68.07 22.73,67.94 MOD1.4
  Bottom 0.254: JP1.9 13.46,73.66 19.05,68.07 v24.38,68.07
STAT  (via drill 0.25 pad 0.51, 0.3 pad 0.51)
  Top 0.254: v23.88,28.07 23.24,28.07 R2.2 R1.2 TP4.P$1 | LIPO1.5 26.16,27.62 26.16,28.19 26.42,28.45 27.18,28.45 v27.18,27.18 | STAT.1 13.97,25.4 14.73,24.64 16.51,24.64 17.53,25.65 v17.53,27.43
  Bottom 0.254: v27.18,27.18 26.29,28.07 v23.88,28.07 18.16,28.07 v17.53,27.43
TX  (via drill 0.25 pad 0.51)
  Top 0.254: MOD1.35 37.98,67.82 v34.8,67.82 | UART.4 43.18,47.75 41.15,49.78 SJ2.2
  Bottom 0.254: v34.8,67.82 36.07,67.82 38.35,65.53 38.35,53.34 43.18,48.51 UART.4
TXLED#/12MHZ_OUT
  Top 0.254: IC1.22 36.35,22.35 36.83,22.35 37.34,22.86 R12.1
UART_RX  (via drill 0.25 pad 0.51)
  Top 0.254: IC1.2 30.97,22.84 30.73,22.61 v30.48,22.61 | v34.29,27.94 34.54,28.19 v34.54,31.24 | v41.91,36.07 41.91,36.83 39.62,39.12 39.62,42.93 37.08,45.47 37.08,48.77 38.1,49.78 SJ2.1
  Bottom 0.254: v30.48,22.61 29.21,23.88 29.21,25.15 31.5,27.43 33.78,27.43 v34.29,27.94 | v34.54,31.24 34.54,33.02 35.31,33.78 41.4,33.78 41.91,34.29 v41.91,36.07
UART_TX  (via drill 0.25 pad 0.51)
  Top 0.254: IC1.30 33.29,25.39 v33.27,25.4 | v35.56,27.94 v35.56,31.24 | v43.18,36.32 43.18,37.08 40.64,39.62 40.64,43.43 39.12,44.96 SJ1.1
  Bottom 0.254: v35.56,27.94 35.56,27.69 v33.27,25.4 | v35.56,31.24 35.56,32.26 36.07,32.77 42.42,32.77 43.18,33.53 v43.18,36.32
USB+
  Top 0.254: IC1.14 34.8,19.28 34.8,18.54 34.05,17.79 31.89,17.79 27.19,13.1 CN1.D+
USB-
  Top 0.254: CN1.D- 29.19,13.97 32.45,17.23 34.31,17.23 35.29,18.2 IC1.15
VBAT_CHG  (via drill 0.25 pad 0.51)
  Top 0.254: LIPO1.4 26.15,23.88 | 26.15,23.88 26.15,23.13 | 26.15,23.13 26.15,22.87 C5.1 | LIPO1.3 25.65,23.63 26.15,23.13 | 26.15,23.88 26.67,23.88 TP6.P$1 29.72,26.92 36.07,26.92 36.45,27.3 PCHAN2.1 36.58,30.11 v36.58,31.24 | v41.4,31.5 41.4,34.29 42.42,35.31 43.69,35.31 44.2,35.81 44.7,35.81 SW_BATTMODE.C
  Bottom 0.254: v41.4,31.5 39.88,31.5 39.62,31.24 v36.58,31.24
VBAT_IN  (via drill 0.25 pad 0.51, 0.3 pad 0.51)
  Top 0.254: LIPO1.2 25.15,23.37 25.02,23.24 | 25.02,23.24 24.38,22.61 C4.1 v24.38,21.34 | LIPO1.1 24.65,23.61 25.02,23.24 | LED_CHG.A 16.27,31.99 15.49,31.24 v15.49,26.16 | PCHAN1.3 32.26,29.86 v32.26,28.7 | SWCHARGE.B 43.45,25.64 42.16,26.92 v42.16,28.45 | TP3.P$1 v20.83,21.36
  Bottom 0.254: 20.83,21.34 v24.38,21.34 24.38,20.83 24.89,20.32 26.42,20.32 28.45,22.35 28.45,25.91 31.24,28.7 v32.26,28.7 37.34,28.7 39.62,26.42 39.62,24.89 40.39,24.13 41.66,24.13 42.16,24.64 v42.16,28.45 | 20.83,21.34 17.27,21.34 15.49,23.11 v15.49,26.16 | v20.83,21.36 20.83,21.34
VCC  (via drill 0.25 pad 0.51, 0.3 pad 0.51)
  Top 0.254: C8.2 17.53,70.61 C7.2 18.67,70.48 MOD1.2 25.28,70.48 v25.4,70.36 | C2.1 27.11,30.41 LDO1.VOUT 27.13,31.24 28.96,31.24 v29.72,32 38.1,32 38.99,31.11 PCHAN2.3 | v17.53,64.77 R6.2 17.1,67.73 RGB1.1 | JTAG.2 25.4,43.18 17.78,43.18 | v17.78,42.42 17.78,43.18 | 17.78,43.18 16.51,44.45 v15.49,44.45
  Bottom 0.254: v25.4,70.36 25.4,65.02 24.64,64.26 | 24.64,64.26 18.03,64.26 v17.53,64.77 | v15.49,44.45 15.49,57.15 17.53,59.18 24.64,59.18 25.4,59.94 25.4,63.5 24.64,64.26 | v29.72,32 29.72,34.29 26.67,37.34 | 26.67,37.34 20.83,37.34 17.78,40.39 v17.78,42.42 | UART.2 44.96,40.13 44.96,38.86 43.43,37.34 26.67,37.34
VIN_LDO  (via drill 0.25 pad 0.51)
  Top 0.254: C3.1 24.89,33.78 26.16,33.78 26.18,33.76 LDO1.VIN 26.9,33.76 C1.1 v28.7,33.02 | PCHAN1.1 29.72,29.86 v29.72,28.7 | SJ3.2 v41.15,25.15 41.15,28.7 43.72,31.28 SW_BATTMODE.A
  Bottom 0.254: 29.46,29.72 29.46,28.96 v29.72,28.7 | 29.46,29.72 29.46,29.97 28.7,30.73 v28.7,33.02 | 29.46,29.72 37.85,29.72 41.15,26.42 v41.15,25.15
VLIPO  (via drill 0.25 pad 0.51)
  Top 0.254: v44.2,33.02 44.22,33.05 44.22,34.02 44.48,34.28 SW_BATTMODE.B | CN_BATT_CHARGE.2 39.64,14.49 40.64,15.49 v44.2,15.49
  Bottom 0.254: v44.2,15.49 44.2,28.96 42.93,30.23 42.93,31.75 v44.2,33.02
VUSB  (via drill 0.25 pad 0.51)
  Top 0.254: IC1.1 29.75,23.34 | 29.75,23.34 C12.2 29.72,24.13 v30.23,24.64 | 29.75,23.34 29.72,23.31 C13.2 29.72,18.8 R11.1 | IC1.19 36.35,20.83 37.06,20.83 v37.31,20.57 | SWPOWER.B 43.19,17.01 v43.18,17.02 41.91,17.02 41.4,16.51 v40.39,16.51 | v41.91,19.56 41.91,20.83 SJ3.1
  Bottom 0.254: v30.23,24.64 35.05,24.64 37.31,22.38 v37.31,20.57 37.31,18.26 36.58,17.53 36.58,17.02 37.08,16.51 v40.39,16.51 | v43.18,17.02 41.91,18.29 v41.91,19.56
VUSB_
  Top 0.254: CN1.VBUS 31.69,13.46 33.73,15.49 C10.2 38.86,15.49 FB1.1
VUSB_FILTERED  (via drill 0.25 pad 0.51)
  Top 0.254: SWPOWER.C 44.7,18.54 v43.18,18.54 39.88,18.54 39.62,18.29 39.62,17.78 FB1.2 | v43.18,28.45 43.18,27.69 43.72,27.14 SWCHARGE.C
  Bottom 0.254: v43.18,18.54 v43.18,28.45

### Text on the board
tPlace: 1.0.1 | OFF/CHG | USE BATT | LiPO mA | CHG EN | 2kOhm = 500mA | 1000V / kOhm | ON | OFF | - | +
bPlace: HTTPS://HACKER.HOUSE | VIN 6V MAX | Designed by / Femtoduino / for / Hacker House | BATTERY / MODE | CHARGER | USB / POWER | LIPO / 6V, 1500uA MAX
tNames: IO23 | SVP | SVN | IO22 | IO34 | IO21 | IO35 | IO19 | IO18 | IO32/R | IO5 | IO33/G | IO25 | IO17 | IO26 | IO16 | IO27/B | URX/TX | IO4 | GND | BOOT | GND | 3.3V | TX | UTX/RX | RX | 3.3V | VCC | VBAT CHG | SD2 | SD3 | CMD | CLK | SD0 | SD1 | IO2 | GND | VBAT IN | VIN (6V MAX) | GND | USB LDO